# EAGLE design RailDriver (EAGLE 6.6.0)

## Sheet 1 of 2
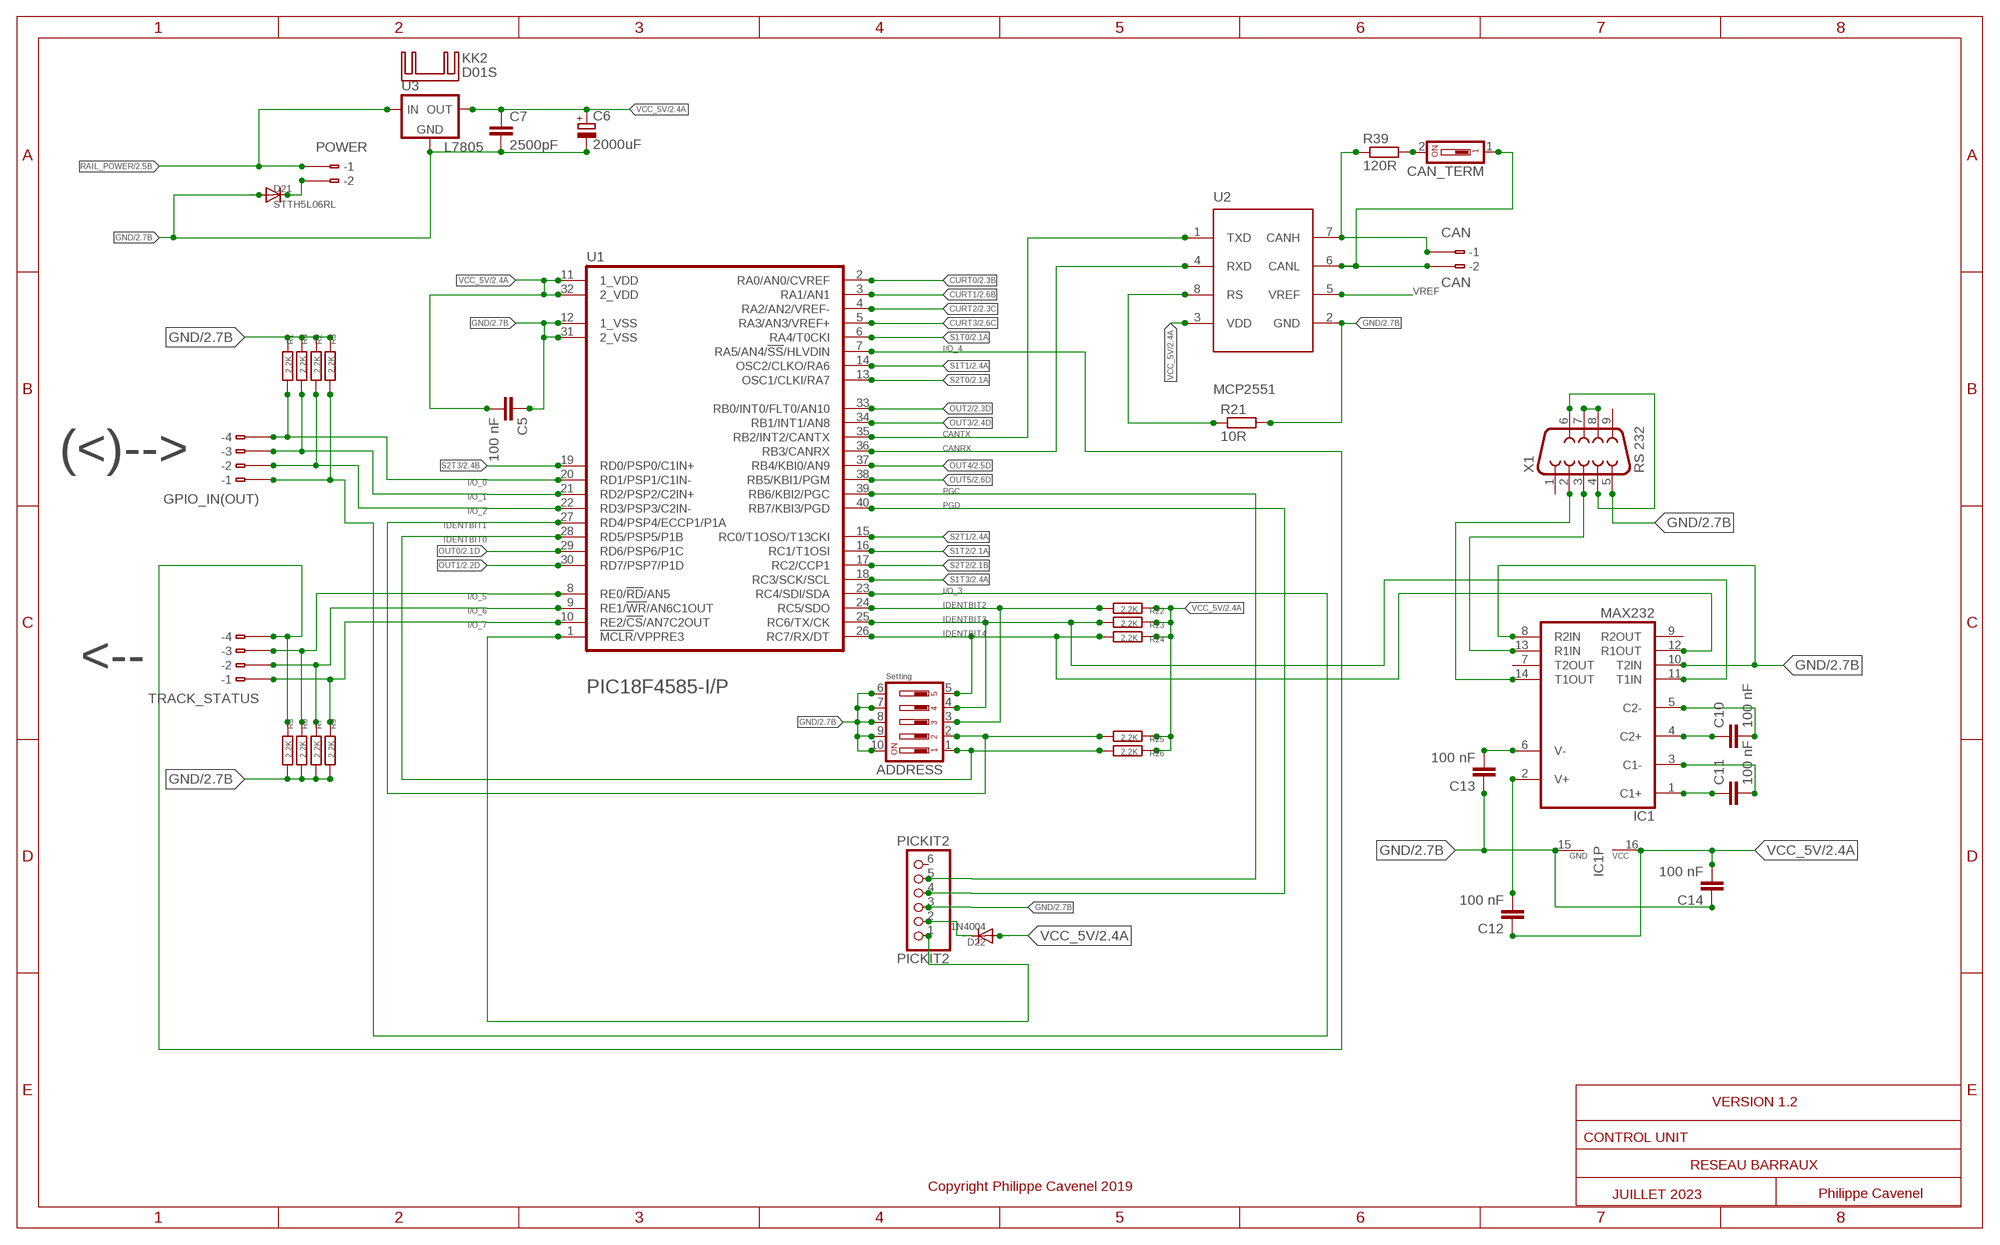
[diagram p0: schematic, sheet 1]

### Parts
ADDRESS  DIP05YL  [DIP05YL]
C5  100 nF  C-EU050-024X044  [C050-024X044]
C6  2000uF  CPOL-EUE3.5-10  [E3,5-10]
C7  2500pF  C-EU050-024X044  [C050-024X044]
C10  100 nF  C-EU050-024X044  [C050-024X044]
C11  100 nF  C-EU050-024X044  [C050-024X044]
C12  100 nF  C-EU050-024X044  [C050-024X044]
C13  100 nF  C-EU050-024X044  [C050-024X044]
C14  100 nF  C-EU050-024X044  [C050-024X044]
CAN  CAN  233-502  [233-502]
CAN_TERM  DS01  [DS-01]
D21  STTH5L06RL  1N5400  [DO201-15]
D22  1N4004  [DO41-10]
GPIO_IN(OUT)  233-504  [233-504]
IC1  MAX232  [DIL16]
KK2  D01S  [D01S]
PICKIT2  PICKIT2  PINHD-1X6  [1X06]
POWER  233-502  [233-502]
R1  2,2K  R-EU_0204/7  [0204/7]
R2  2,2K  R-EU_0204/7  [0204/7]
R3  2,2K  R-EU_0204/7  [0204/7]
R4  2,2K  R-EU_0204/7  [0204/7]
R5  2,2K  R-EU_0204/7  [0204/7]
R6  2,2K  R-EU_0204/7  [0204/7]
R7  2,2K  R-EU_0204/7  [0204/7]
R9  2,2K  R-EU_0204/7  [0204/7]
R21  10R  R-EU_0204/7  [0204/7]
R22  2,2K  R-EU_0204/7  [0204/7]
R23  2,2K  R-EU_0204/7  [0204/7]
R24  2,2K  R-EU_0204/7  [0204/7]
R25  2,2K  R-EU_0204/7  [0204/7]
R26  2,2K  R-EU_0204/7  [0204/7]
R39  120R  R-EU_0204/7  [0204/7]
TRACK_STATUS  233-504  [233-504]
U1  PIC18F4585-I  MICROCHIP_PIC18F4585-I-PDIL_SOCKET40W  [DIL_SOCKET40W]
U2  MCP2551  MCP2551P  [DIL_SOCKET8]
U3  L7805  78XX-TO220V  [TO220BV]
X1  RS 232  F09HP  [F09HP]

### Nets
CANRX: U1.36(RB3/CANRX) U2.4(RXD)
CANTX: U1.35(RB2/INT2/CANTX) U2.1(TXD)
CURT0: U1.2(RA0/AN0/CVREF) ; also sheet 2
CURT1 [VSS]: U1.3(RA1/AN1) ; also sheet 2
CURT2 [VSS]: U1.4(RA2/AN2/VREF-) ; also sheet 2
CURT3 [VSS]: U1.5(RA3/AN3/VREF+) ; also sheet 2
GND [VSS]: ADDRESS.6 ADDRESS.7 ADDRESS.8 ADDRESS.9 ADDRESS.10 C5.1 C6.- C7.2 C13.1 C14.1 D21.A IC1.8(R2IN) IC1.10(T2IN) IC1.15(GND) PICKIT2.3 R1.2 R2.2 R3.2 R4.2 R5.1 R6.1 R7.1 R9.1 R21.2 U1.12(1_VSS) U1.31(2_VSS) U2.2(GND) U3.2(GND) X1.5 ; also sheet 2
I/O_0: GPIO_IN(OUT).B4(B-4) R1.1 U1.20(RD1/PSP1/C1IN-)
I/O_1: GPIO_IN(OUT).B3(B-3) R4.1 U1.21(RD2/PSP2/C2IN+)
I/O_2: GPIO_IN(OUT).B2(B-2) R2.1 U1.22(RD3/PSP3/C2IN-)
I/O_3: GPIO_IN(OUT).B1(B-1) R3.1 U1.23(RC4/SDI/SDA)
I/O_4: R5.2 TRACK_STATUS.B4(B-4) U1.7(RA5/AN4/!SS!/HLVDIN)
I/O_5: R6.2 TRACK_STATUS.B3(B-3) U1.8(RE0/!RD!/AN5)
I/O_6: R7.2 TRACK_STATUS.B2(B-2) U1.9(RE1/!WR!/AN6C1OUT)
I/O_7: R9.2 TRACK_STATUS.B1(B-1) U1.10(RE2/!CS!/AN7C2OUT)
IDENTBIT0: ADDRESS.1 R26.1 U1.28(RD5/PSP5/P1B)
IDENTBIT1: ADDRESS.2 R25.1 U1.27(RD4/PSP4/ECCP1/P1A)
IDENTBIT2: ADDRESS.3 R22.1 U1.24(RC5/SDO)
IDENTBIT3: ADDRESS.4 IC1.11(T1IN) R23.1 U1.25(RC6/TX/CK)
IDENTBIT4: ADDRESS.5 IC1.12(R1OUT) R24.1 U1.26(RC7/RX/DT)
N$1: D22.C PICKIT2.2
N$2: CAN_TERM.2 R39.2
N$8: C10.2 IC1.5(C2-)
N$9: C10.1 IC1.4(C2+)
N$10: C11.1 IC1.1(C1+)
N$11: C11.2 IC1.3(C1-)
N$12: C12.2 IC1.2(V+)
N$13: C13.2 IC1.6(V-)
N$15: IC1.13(R1IN) X1.3
N$16: IC1.14(T1OUT) X1.2
N$17: X1.4 X1.6
N$18: X1.7 X1.8
N$20: CAN.B1(B-1) R39.1 U2.7(CANH)
N$21: CAN.B2(B-2) CAN_TERM.1 U2.6(CANL)
N$27: R21.1 U2.8(RS)
N$29 [VSS]: D21.C POWER.B2(B-2)
N$117: PICKIT2.1 U1.1(!MCLR!/VPPRE3)
OUT0: U1.29(RD6/PSP6/P1C) ; also sheet 2
OUT1: U1.30(RD7/PSP7/P1D) ; also sheet 2
OUT2: U1.33(RB0/INT0/FLT0/AN10) ; also sheet 2
OUT3: U1.34(RB1/INT1/AN8) ; also sheet 2
OUT4: U1.37(RB4/KBI0/AN9) ; also sheet 2
OUT5: U1.38(RB5/KBI1/PGM) ; also sheet 2
PGC: PICKIT2.5 U1.39(RB6/KBI2/PGC)
PGD: PICKIT2.4 U1.40(RB7/KBI3/PGD)
RAIL_POWER [VSS]: POWER.B1(B-1) U3.1(VIN) ; also sheet 2
S1T0: U1.6(RA4/T0CKI) ; also sheet 2
S1T1: U1.14(OSC2/CLKO/RA6) ; also sheet 2
S1T2: U1.16(RC1/T1OSI) ; also sheet 2
S1T3: U1.18(RC3/SCK/SCL) ; also sheet 2
S2T0: U1.13(OSC1/CLKI/RA7) ; also sheet 2
S2T1: U1.15(RC0/T1OSO/T13CKI) ; also sheet 2
S2T2: U1.17(RC2/CCP1) ; also sheet 2
S2T3: U1.19(RD0/PSP0/C1IN+) ; also sheet 2
VCC_5V [VCC]: C5.2 C6.+ C7.1 C12.1 C14.2 D22.A IC1.16(VCC) R22.2 R23.2 R24.2 R25.2 R26.2 U1.11(1_VDD) U1.32(2_VDD) U2.3(VDD) U3.3(VOUT) ; also sheet 2
VREF: U2.5(VREF)
Unconnected: CAN.A1(-1) CAN.A2(-2) GPIO_IN(OUT).A1(-1) GPIO_IN(OUT).A2(-2) GPIO_IN(OUT).A3(-3) GPIO_IN(OUT).A4(-4) IC1.7(T2OUT) IC1.9(R2OUT) PICKIT2.6 POWER.A1(-1) POWER.A2(-2) TRACK_STATUS.A1(-1) TRACK_STATUS.A2(-2) TRACK_STATUS.A3(-3) TRACK_STATUS.A4(-4) X1.1 X1.9

### Notes on the sheet
- (<)-->
- <--
- Setting
- VERSION 1.2
- CONTROL UNIT
- RESEAU BARRAUX
- Copyright Philippe Cavenel 2019
- JUILLET 2023 | Philippe Cavenel

## Sheet 2 of 2
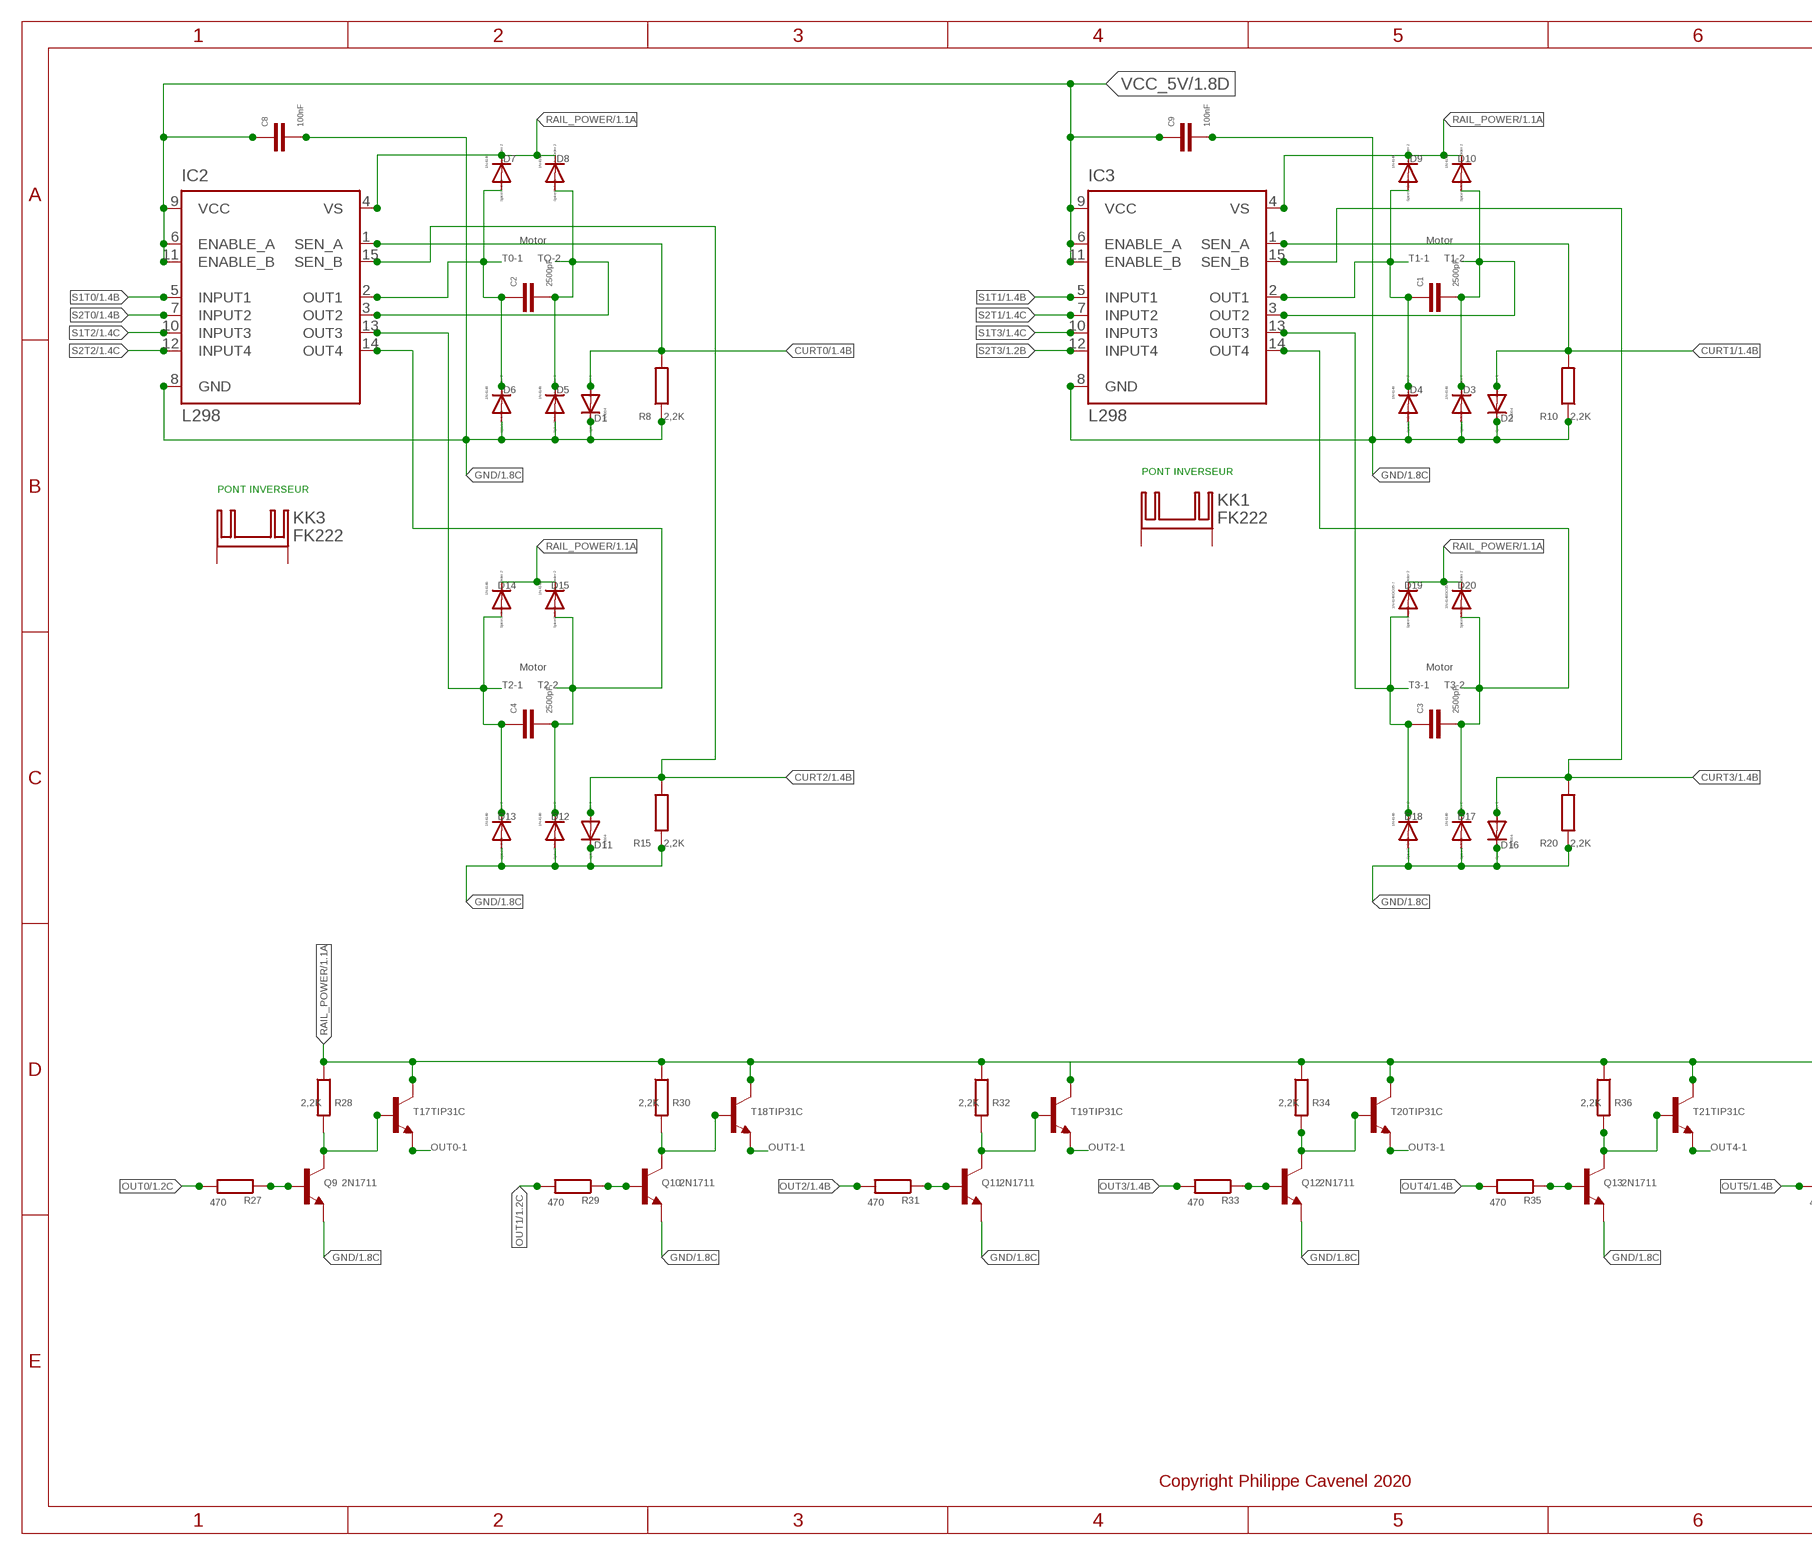
[diagram p1: schematic, sheet 2, part 1 of 2]
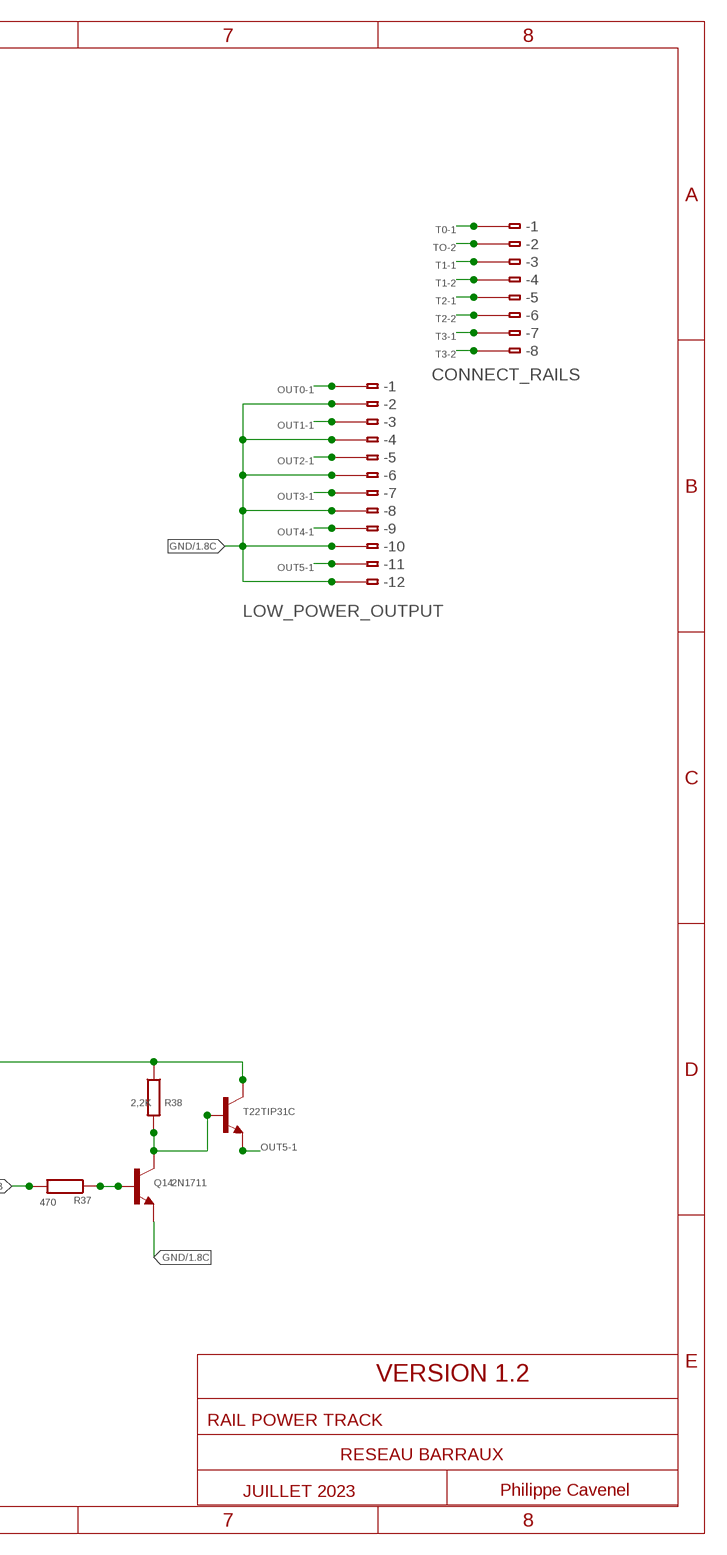
[diagram p2: schematic, sheet 2, part 2 of 2]

### Parts
C1  2500pF  C-EU050-024X044  [C050-024X044]
C2  2500pF  C-EU050-024X044  [C050-024X044]
C3  2500pF  C-EU050-024X044  [C050-024X044]
C4  2500pF  C-EU050-024X044  [C050-024X044]
C8  100nF  C-EU050-024X044  [C050-024X044]
C9  100nF  C-EU050-024X044  [C050-024X044]
CONNECT_RAILS  233-508  [233-508]
D1  1N4004  [DO41-10]
D2  1N4004  [DO41-10]
D3  1N4148  1N4148DO35-7  [DO35-7]
D4  1N4148  1N4148DO35-7  [DO35-7]
D5  1N4148  1N4148DO35-7  [DO35-7]
D6  1N4148  1N4148DO35-7  [DO35-7]
D7  1N4148  1N4148DO35-7  [DO35-7]
D8  1N4148  1N4148DO35-7  [DO35-7]
D9  1N4148  1N4148DO35-7  [DO35-7]
D10  1N4148  1N4148DO35-7  [DO35-7]
D11  1N4004  [DO41-10]
D12  1N4148  1N4148DO35-7  [DO35-7]
D13  1N4148  1N4148DO35-7  [DO35-7]
D14  1N4148  1N4148DO35-7  [DO35-7]
D15  1N4148  1N4148DO35-7  [DO35-7]
D16  1N4004  [DO41-10]
D17  1N4148  1N4148DO35-7  [DO35-7]
D18  1N4148  1N4148DO35-7  [DO35-7]
D19  1N4148DO35-7  [DO35-7]
D20  1N4148DO35-7  [DO35-7]
IC2  L298  [MULTIWATT-15]
IC3  L298  [MULTIWATT-15]
KK1  FK222  [FK222]
KK3  FK222  [FK222]
LOW_POWER_OUTPUT  233-512  [233-512]
Q9  2N1711  [TO39]
Q10  2N1711  [TO39]
Q11  2N1711  [TO39]
Q12  2N1711  [TO39]
Q13  2N1711  [TO39]
Q14  2N1711  [TO39]
R8  2,2K  R-EU_0204/7  [0204/7]
R10  2,2K  R-EU_0204/7  [0204/7]
R15  2,2K  R-EU_0204/7  [0204/7]
R20  2,2K  R-EU_0204/7  [0204/7]
R27  470  R-EU_0204/7  [0204/7]
R28  2,2K  R-EU_0204/7  [0204/7]
R29  470  R-EU_0204/7  [0204/7]
R30  2,2K  R-EU_0204/7  [0204/7]
R31  470  R-EU_0204/7  [0204/7]
R32  2,2K  R-EU_0204/7  [0204/7]
R33  470  R-EU_0204/7  [0204/7]
R34  2,2K  R-EU_0204/7  [0204/7]
R35  470  R-EU_0204/7  [0204/7]
R36  2,2K  R-EU_0204/7  [0204/7]
R37  470  R-EU_0204/7  [0204/7]
R38  2,2K  R-EU_0204/7  [0204/7]
T17  TIP31C  [TO220]
T18  TIP31C  [TO220]
T19  TIP31C  [TO220]
T20  TIP31C  [TO220]
T21  TIP31C  [TO220]
T22  TIP31C  [TO220]

### Nets
CURT0: D1.A IC2.1(SEN_A) R8.2 ; also sheet 1
CURT1 [VSS]: D2.A IC3.1(SEN_A) R10.2 ; also sheet 1
CURT2 [VSS]: D11.A IC2.15(SEN_B) R15.2 ; also sheet 1
CURT3 [VSS]: D16.A IC3.15(SEN_B) R20.2 ; also sheet 1
GND [VSS]: C8.2 C9.2 D1.C D2.C D3.A D4.A D5.A D6.A D11.C D12.A D13.A D16.C D17.A D18.A IC2.8(GND) IC3.8(GND) LOW_POWER_OUTPUT.B2(B-2) LOW_POWER_OUTPUT.B4(B-4) LOW_POWER_OUTPUT.B6(B-6) LOW_POWER_OUTPUT.B8(B-8) LOW_POWER_OUTPUT.B10(B-10) LOW_POWER_OUTPUT.B12(B-12) Q9.1(E) Q10.1(E) Q11.1(E) Q12.1(E) Q13.1(E) Q14.1(E) R8.1 R10.1 R15.1 R20.1 ; also sheet 1
N$28: Q9.3(C) R28.2 T17.1(B)
N$30: Q9.2(B) R27.1
N$31: Q10.3(C) R30.2 T18.1(B)
N$33: Q10.2(B) R29.1
N$34: Q11.3(C) R32.2 T19.1(B)
N$36: Q11.2(B) R31.1
N$37: Q12.3(C) R34.2 T20.1(B)
N$39: Q12.2(B) R33.1
N$40: Q13.3(C) R36.2 T21.1(B)
N$42: Q13.2(B) R35.1
N$43: Q14.3(C) R38.2 T22.1(B)
N$45: Q14.2(B) R37.1
OUT0: R27.2 ; also sheet 1
OUT0-1 [VSS]: LOW_POWER_OUTPUT.B1(B-1) T17.3(E)
OUT1: R29.2 ; also sheet 1
OUT1-1 [VSS]: LOW_POWER_OUTPUT.B3(B-3) T18.3(E)
OUT2: R31.2 ; also sheet 1
OUT2-1 [VSS]: LOW_POWER_OUTPUT.B5(B-5) T19.3(E)
OUT3: R33.2 ; also sheet 1
OUT3-1 [VSS]: LOW_POWER_OUTPUT.B7(B-7) T20.3(E)
OUT4: R35.2 ; also sheet 1
OUT4-1 [VSS]: LOW_POWER_OUTPUT.B9(B-9) T21.3(E)
OUT5: R37.2 ; also sheet 1
OUT5-1 [VSS]: LOW_POWER_OUTPUT.B11(B-11) T22.3(E)
RAIL_POWER [VSS]: D7.C D8.C D9.C D10.C D14.C D15.C D19.C D20.C IC2.4(VS) IC3.4(VS) R28.1 R30.1 R32.1 R34.1 R36.1 R38.1 T17.2(C) T18.2(C) T19.2(C) T20.2(C) T21.2(C) T22.2(C) ; also sheet 1
S1T0: IC2.5(INPUT1) ; also sheet 1
S1T1: IC3.5(INPUT1) ; also sheet 1
S1T2: IC2.10(INPUT3) ; also sheet 1
S1T3: IC3.10(INPUT3) ; also sheet 1
S2T0: IC2.7(INPUT2) ; also sheet 1
S2T1: IC3.7(INPUT2) ; also sheet 1
S2T2: IC2.12(INPUT4) ; also sheet 1
S2T3: IC3.12(INPUT4) ; also sheet 1
T0-1 [VSS]: C2.1 CONNECT_RAILS.B1(B-1) D6.C D7.A IC2.2(OUT1)
T1-1 [VSS]: C1.1 CONNECT_RAILS.B3(B-3) D4.C D9.A IC3.2(OUT1)
T1-2 [VSS]: C1.2 CONNECT_RAILS.B4(B-4) D3.C D10.A IC3.3(OUT2)
T2-1 [VSS]: C4.1 CONNECT_RAILS.B5(B-5) D13.C D14.A IC2.13(OUT3)
T2-2 [VSS]: C4.2 CONNECT_RAILS.B6(B-6) D12.C D15.A IC2.14(OUT4)
T3-1 [VSS]: C3.1 CONNECT_RAILS.B7(B-7) D18.C D19.A IC3.13(OUT3)
T3-2 [VSS]: C3.2 CONNECT_RAILS.B8(B-8) D17.C D20.A IC3.14(OUT4)
TO-2 [VSS]: C2.2 CONNECT_RAILS.B2(B-2) D5.C D8.A IC2.3(OUT2)
VCC_5V [VCC]: C8.1 C9.1 IC2.6(ENABLE_A) IC2.9(VCC) IC2.11(ENABLE_B) IC3.6(ENABLE_A) IC3.9(VCC) IC3.11(ENABLE_B) ; also sheet 1
Unconnected: CONNECT_RAILS.A1(-1) CONNECT_RAILS.A2(-2) CONNECT_RAILS.A3(-3) CONNECT_RAILS.A4(-4) CONNECT_RAILS.A5(-5) CONNECT_RAILS.A6(-6) CONNECT_RAILS.A7(-7) CONNECT_RAILS.A8(-8) KK1.A2,8(K) KK1.B2,8(K) KK3.A2,8(K) KK3.B2,8(K) LOW_POWER_OUTPUT.A1(-1) LOW_POWER_OUTPUT.A2(-2) LOW_POWER_OUTPUT.A3(-3) LOW_POWER_OUTPUT.A4(-4) LOW_POWER_OUTPUT.A5(-5) LOW_POWER_OUTPUT.A6(-6) LOW_POWER_OUTPUT.A7(-7) LOW_POWER_OUTPUT.A8(-8) LOW_POWER_OUTPUT.A9(-9) LOW_POWER_OUTPUT.A10(-10) LOW_POWER_OUTPUT.A11(-11) LOW_POWER_OUTPUT.A12(-12)

### Notes on the sheet
- Motor | Motor
- PONT INVERSEUR
- PONT INVERSEUR
- Motor | Motor
- VERSION 1.2
- RAIL POWER TRACK
- RESEAU BARRAUX
- Copyright Philippe Cavenel 2020
- JUILLET 2023 | Philippe Cavenel

## Library data of the parts
ADDRESS = switch-dil:DIP05YL: DIL/CODE SWITCH; OC_FARNELL: unknown; OC_NEWARK: unknown
C1-C5 C7-C14 = resistor:C-EU: CAPACITOR, European symbol
C6 = rcl:CPOL-EU: POLARIZED CAPACITOR, European symbol
CAN POWER = con-wago:233-502: WAGO Cage Clamp; MPN: 233-502; OC_FARNELL: 1777096; OC_NEWARK: 58M2630
CAN_TERM = switch-dil:DS01: DIL/CODE SWITCH; OC_FARNELL: unknown; OC_NEWARK: unknown
CONNECT_RAILS = con-wago:233-508: WAGO Cage Clamp; MF: Wago Corporation; MPN: 0233-0508; OC_FARNELL: 1777101; OC_NEWARK: 79K2053
D1 D2 D11 D16 D22 = diode:1N4004: DIODE general purpose rectifier, 1 A
D3-D10 D12-D15 D17-D20 = diode:1N4148: DIODE high speed (Philips)
D21 = diode:1N5400: DIODE standard rectifier, 3 A, 50 V (Motorola)
GPIO_IN(OUT) TRACK_STATUS = con-wago:233-504: WAGO Cage Clamp; MF: Wago Corporation; MPN: 0233-0504; OC_FARNELL: 1777098; OC_NEWARK: 79K2050
IC1 = maxim:MAX232: RS232 TRANSCEIVER; MF: MAXIM; MPN: MAX232ACPE+; OC_FARNELL: 9723773; OC_NEWARK: 68K4544
IC2 IC3 = st-microelectronics:L298: DUAL FULL-BRIDGE DRIVER; MPN: L298N; OC_FARNELL: 1589425; OC_NEWARK: 32M1527
KK1 KK3 = heatsink:FK222: HEATSINK manufacturer Fischer/distributor Buerklin
KK2 = heatsink:D01S: HEATSINK distributor Schukat
LOW_POWER_OUTPUT = con-wago:233-512: WAGO Cage Clamp; MF: Wago Corporation; MPN: 0233-0512; OC_FARNELL: 1777102; OC_NEWARK: 79K2055
PICKIT2 = pinhead:PINHD-1X6: PIN HEADER
Q9-Q14 = transistor-npn:2N1711: NPN Transistor
R1-R7 R9 R21-R26 R39 = resistor:R-EU_: RESISTOR, European symbol
R8 R10 R15 R20 R27-R38 = rcl:R-EU_: RESISTOR, European symbol
T17-T22 = transistor:TIP31: NPN Transistor Medium Power Linear Switching Applications Source: http://onsemi.com
U1 = PIC18F4585-I:MICROCHIP_PIC18F4585-I-P: MC-8B-18F4585-IL40; CIIVA_IDS: 1159501; DATASHEET_VERSION: revC, Jan-2007; FOOTPRINT_VARIANT_NAME_0: Manufacturer Recommended; IMPORTED: yes; IMPORTED_FROM: vault; IMPORT_TS: 1521860469; MF: Microchip; MPN: PIC18F4585-I/P; PACKAGE: PDIP600-P40; PACKAGE_DESCRIPTION: 40-Lead Plastic Dual In-Line (P) - 600 mil Body [PDIP]; PACKAGE_VERSION: revBB, Aug-2009; PREFIX: U; RELEASE_DATE: 1300262685; VAULT_GUID: 210E116F-6B5F-434B-BA1E-B828BFE41178; VAULT_REVISION: E650CF94-49B9-4BD2-BA8F-78EDCB57BA09
U2 = microchip_can:MCP2551: High Speed CAN tranceiver
U3 = bt_regulator:78XX: 78XX Linear Voltage Regulator The venerable 7800-series Linear Voltage Regulator, including 7805, 7809, 7812, 7815, 7862 in 5 V, 6.2 V, 8.2 V, 9 V, 12 V, and 15 V, respectively Datasheets TI_LM78L05.pdf <http://www.ti.com/lit/ds/symlink/lm78l05.pdf> Fairchild_LM7805.pdf <https://www.fairchildsemi.com/datasheets/LM/LM7805.pdf>
X1 = con-subd:F09: SUB-D; OC_FARNELL: unknown; OC_NEWARK: unknown

## Net classes
0 default: width 0.254 mm, clearance 0.355 mm
1 VSS: width 0.762 mm, clearance 0.355 mm to class 0, clearance 0.355 mm
2 Antenna: width 1.27 mm
3 VCC: width 0.406 mm, clearance 0.355 mm to class 0, clearance 0.355 mm to class 1, clearance 0.355 mm to class 2, clearance 0.355 mm

## Board
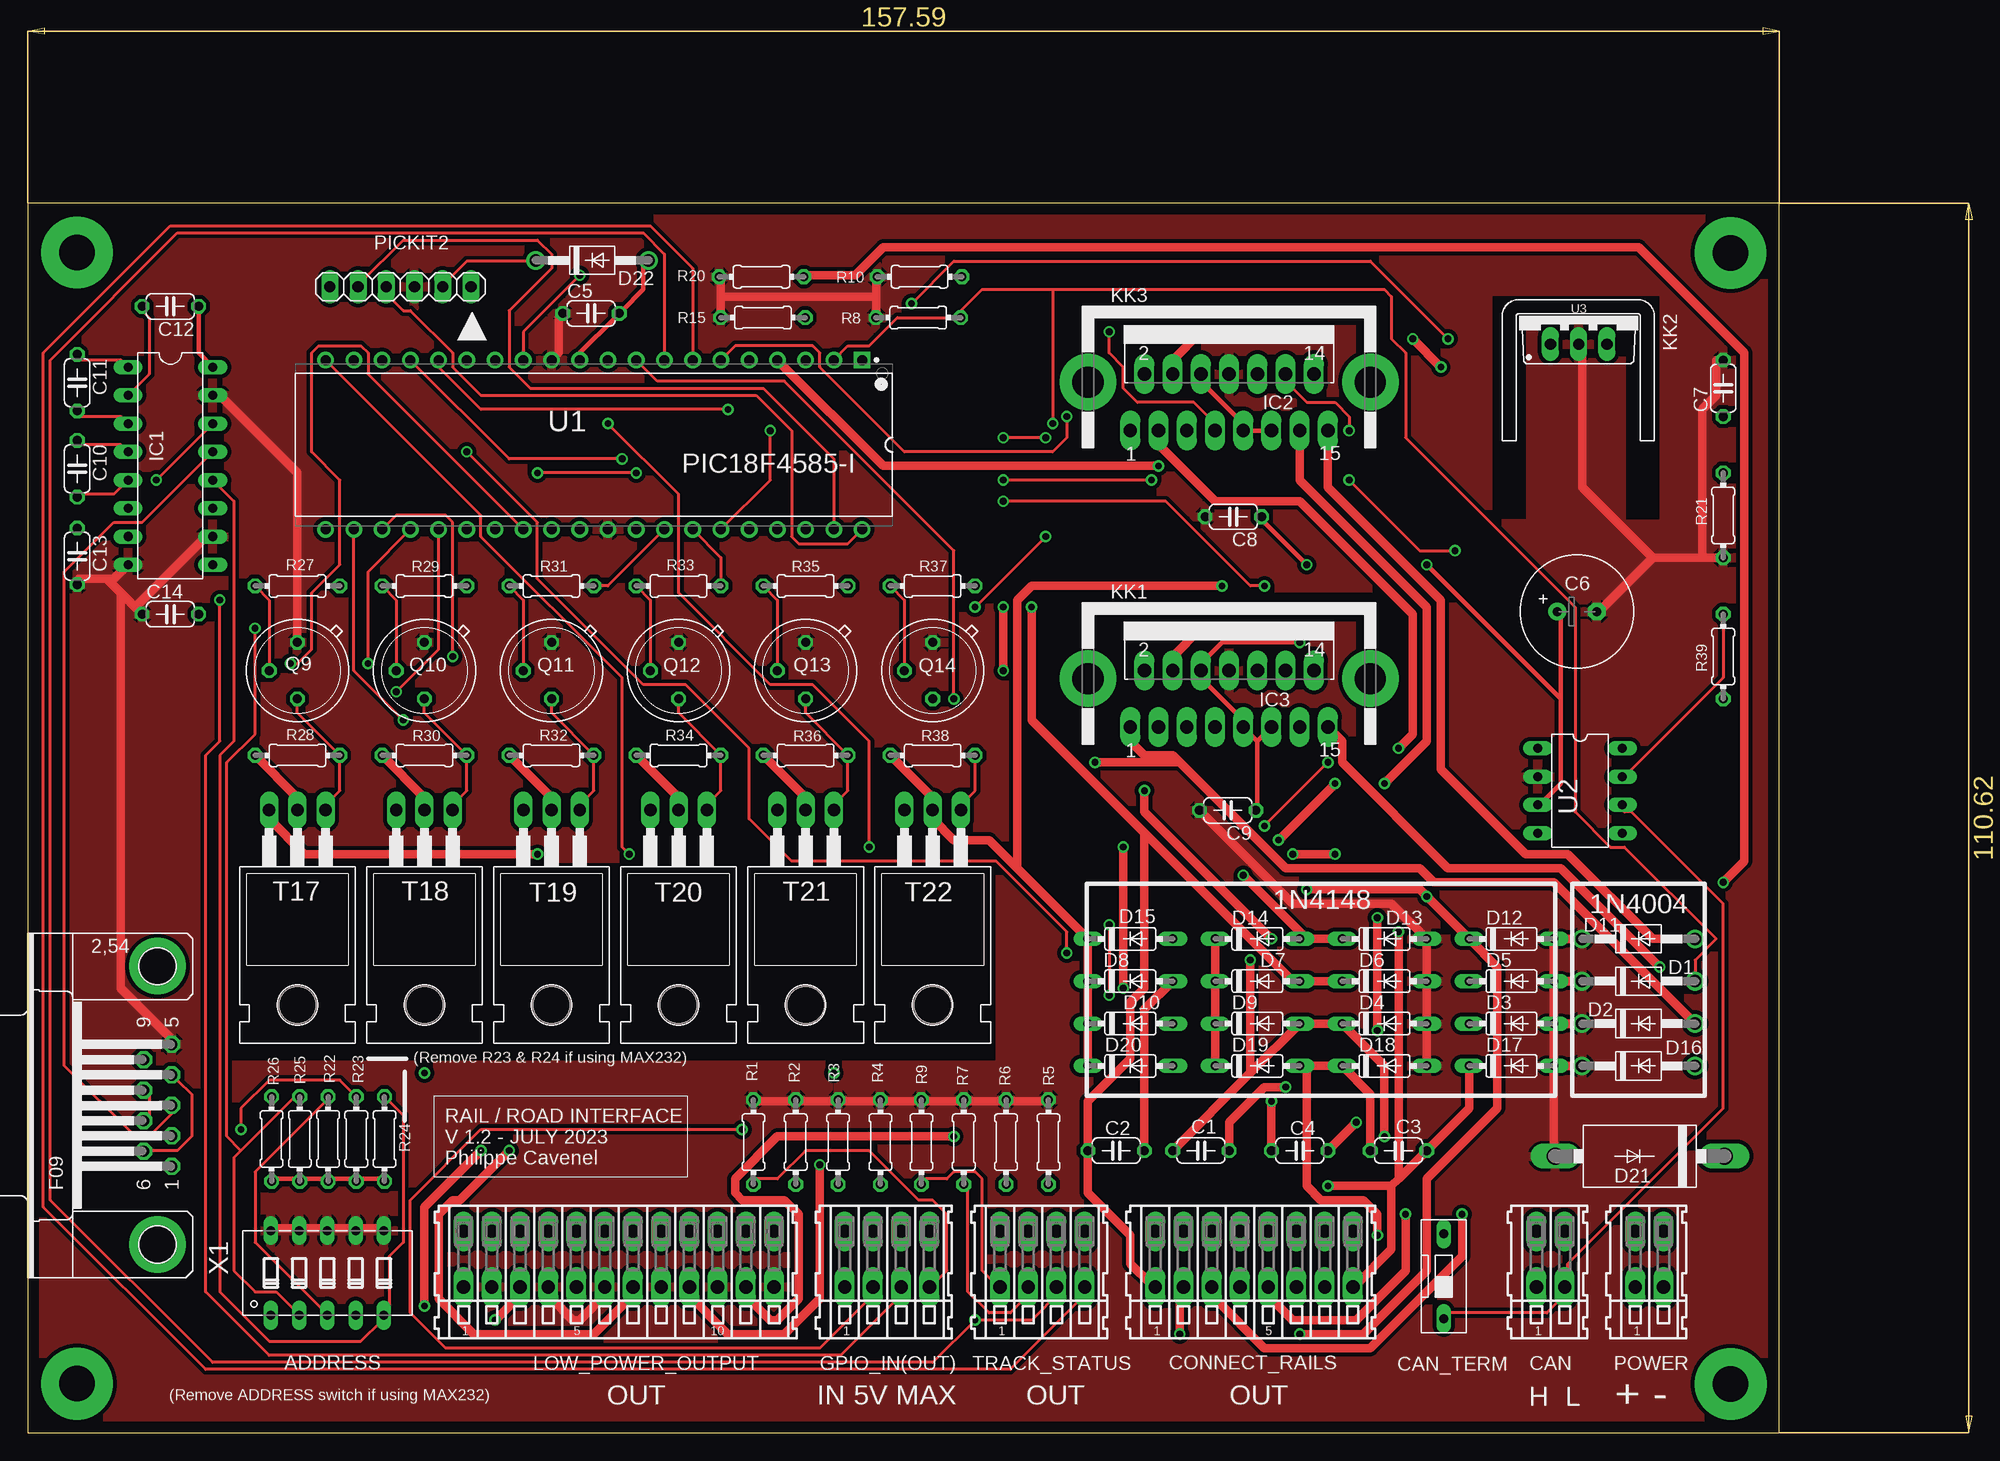
[diagram p3: board, top side]
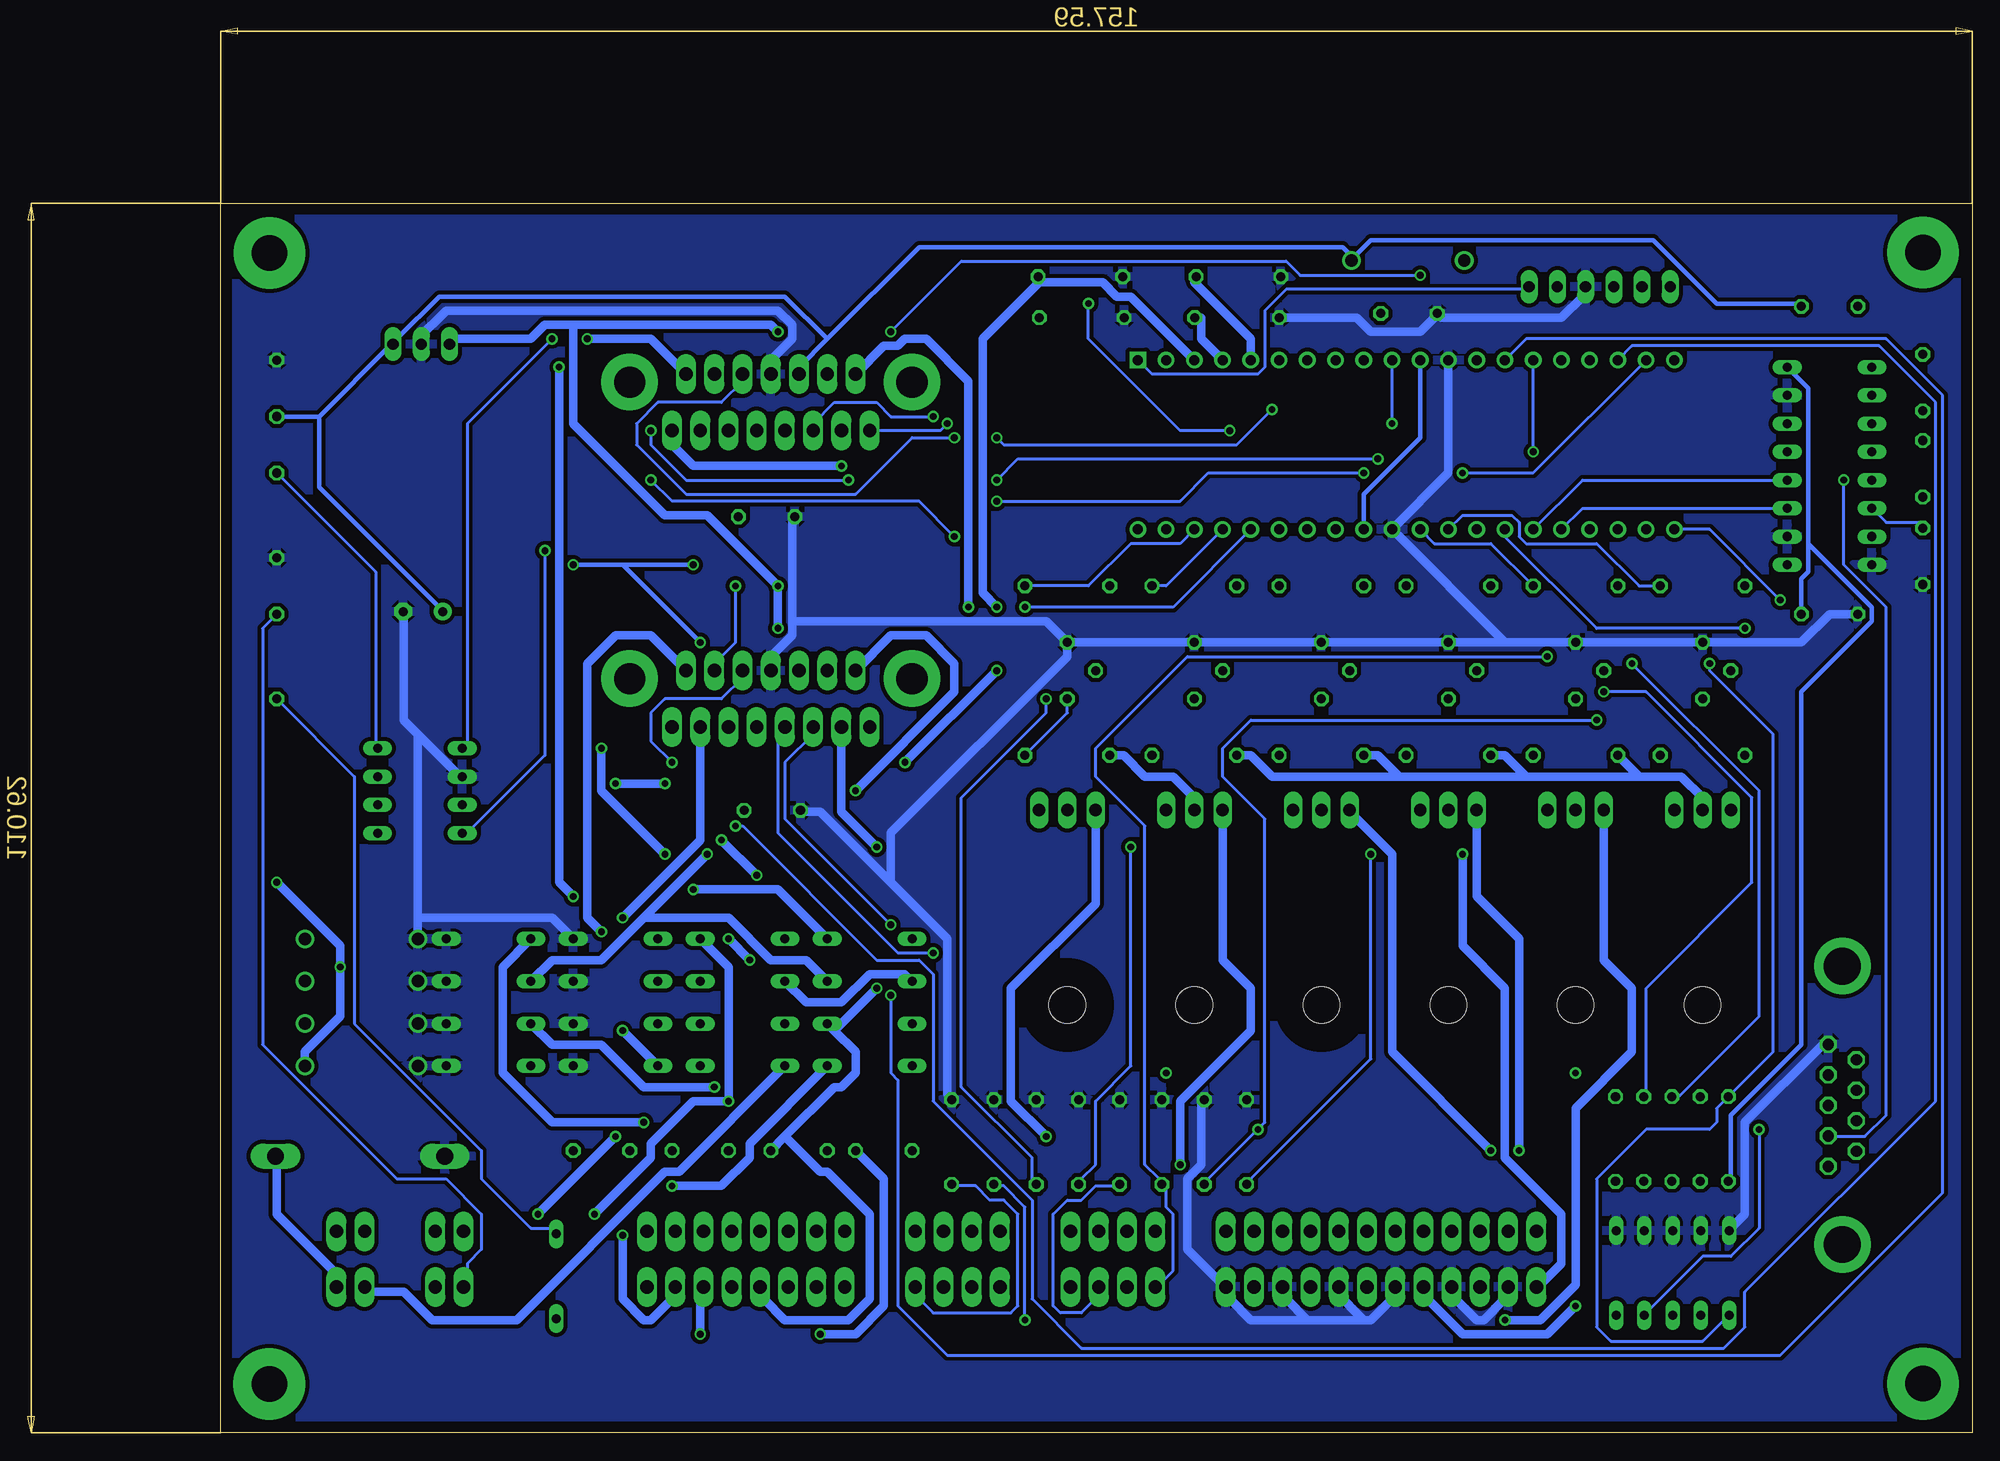
[diagram p4: board, bottom side, seen from below]

Size 157.59 x 110.62 mm. Coordinates in mm from the lower left corner, seen from the top.
Outline: 0,0 22.99,0 45.47,0 157.59,0 157.59,110.62 0,110.62 0,0
Copper layers (1*16): Top 0.035mm / dielectric 1.5mm / Bottom 0.035mm
Design rules "RailDriver": minimum track width 10mil, minimum drill 24mil, track to track 0.205mm, track to pad 0.205mm, pad to pad 0.205mm, via to via 0.205mm, smd to smd 8mil, copper to edge 40mil, drill to drill 8mil, minimum pad ring 10mil, minimum via ring 8mil, stop-mask expansion 4mil, vias tented up to drill 0mil, thermal gap 10mil
tRestrict: area 131.8,99.7 to 146.8,102.3; area 131.8,82.3 to 134.8,102.3; area 143.8,82.2 to 146.8,102.2; area 18.7,33.5 to 87,51.3

### Footprints (pad centres in the part's own frame; a part is rotated, then mirrored left to right if it is on the bottom)
DIP05YL = drill 0.813 long: 1 -5.08,-3.81; 2 -2.54,-3.81; 3 0,-3.81; 4 2.54,-3.81; 5 5.08,-3.81; 6 5.08,3.81; 7 2.54,3.81; 8 0,3.81; 9 -2.54,3.81; 10 -5.08,3.81
C050-024X044 = drill 0.813 octagon: 1 -2.54,0; 2 2.54,0
E3,5-10 = drill 0.813 pad 1.6: + -1.778,0 | drill 0.813 pad 1.6 octagon: - 1.778,0
233-502 = drill 1.2 long: A1 -1.27,2.5; A2 1.27,2.5; B1 -1.27,-2.5; B2 1.27,-2.5
DS-01 = drill 0.813 long: 1 0,-3.81; 2 0,3.81
233-508 = drill 1.2 long: A1 -8.89,2.5; A2 -6.35,2.5; A3 -3.81,2.5; A4 -1.27,2.5; A5 1.27,2.5; A6 3.81,2.5; A7 6.35,2.5; A8 8.89,2.5; B1 -8.89,-2.5; B2 -6.35,-2.5; B3 -3.81,-2.5; B4 -1.27,-2.5; B5 1.27,-2.5; B6 3.81,-2.5; B7 6.35,-2.5; B8 8.89,-2.5
DO41-10 = drill 1.118: A 5.08,0; C -5.08,0
DO35-7 = drill 0.813 long: A 3.81,0; C -3.81,0
DO201-15 = drill 1.499 long: A 7.62,0; C -7.62,0
233-504 = drill 1.2 long: A1 -3.81,2.5; A2 -1.27,2.5; A3 1.27,2.5; A4 3.81,2.5; B1 -3.81,-2.5; B2 -1.27,-2.5; B3 1.27,-2.5; B4 3.81,-2.5
DIL16 = drill 0.813 long: 1 -8.89,-3.81; 2 -6.35,-3.81; 3 -3.81,-3.81; 4 -1.27,-3.81; 5 1.27,-3.81; 6 3.81,-3.81; 7 6.35,-3.81; 8 8.89,-3.81; 9 8.89,3.81; 10 6.35,3.81; 11 3.81,3.81; 12 1.27,3.81; 13 -1.27,3.81; 14 -3.81,3.81; 15 -6.35,3.81; 16 -8.89,3.81
MULTIWATT-15 = drill 1.2 long: 1 -8.89,-7.62; 2 -7.62,-2.54; 3 -6.35,-7.62; 4 -5.08,-2.54; 5 -3.81,-7.62; 6 -2.54,-2.54; 7 -1.27,-7.62; 8 0,-2.54; 9 1.27,-7.62; 10 2.54,-2.54; 11 3.81,-7.62; 12 5.08,-2.54; 13 6.35,-7.62; 14 7.62,-2.54; 15 8.89,-7.62
FK222 = drill 2.794 pad 5.08: A2,8 5.791,-12.7; B2,8 5.791,12.7
233-512 = drill 1.2 long: A1 -13.97,2.5; A2 -11.43,2.5; A3 -8.89,2.5; A4 -6.35,2.5; A5 -3.81,2.5; A6 -1.27,2.5; A7 1.27,2.5; A8 3.81,2.5; A9 6.35,2.5; A10 8.89,2.5; A11 11.43,2.5; A12 13.97,2.5; B1 -13.97,-2.5; B2 -11.43,-2.5; B3 -8.89,-2.5; B4 -6.35,-2.5; B5 -3.81,-2.5; B6 -1.27,-2.5; B7 1.27,-2.5; B8 3.81,-2.5; B9 6.35,-2.5; B10 8.89,-2.5; B11 11.43,-2.5; B12 13.97,-2.5
1X06 = drill 1.016 long: 1 -6.35,0; 2 -3.81,0; 3 -1.27,0; 4 1.27,0; 5 3.81,0; 6 6.35,0
TO39 = drill 0.813 octagon: 1 0,-2.54; 2 2.54,0; 3 0,2.54
0204/7 = drill 0.813 octagon: 1 -3.81,0; 2 3.81,0
TO220 = drill 1.118 long: 1 -2.54,-6.35; 2 0,-6.35; 3 2.54,-6.35 | hole 3.302: 0,11.176
DIL_SOCKET40W = drill 0.9 pad 1.5 square: 1 -24.13,-7.62 | drill 0.9 pad 1.5: 2 -21.59,-7.62; 3 -19.05,-7.62; 4 -16.51,-7.62; 5 -13.97,-7.62; 6 -11.43,-7.62; 7 -8.89,-7.62; 8 -6.35,-7.62; 9 -3.81,-7.62; 10 -1.27,-7.62; 11 1.27,-7.62; 12 3.81,-7.62; 13 6.35,-7.62; 14 8.89,-7.62; 15 11.43,-7.62; 16 13.97,-7.62; 17 16.51,-7.62; 18 19.05,-7.62; 19 21.59,-7.62; 20 24.13,-7.62; 21 24.13,7.62; 22 21.59,7.62; 23 19.05,7.62; 24 16.51,7.62; 25 13.97,7.62; 26 11.43,7.62; 27 8.89,7.62; 28 6.35,7.62; 29 3.81,7.62; 30 1.27,7.62; 31 -1.27,7.62; 32 -3.81,7.62; 33 -6.35,7.62; 34 -8.89,7.62; 35 -11.43,7.62; 36 -13.97,7.62; 37 -16.51,7.62; 38 -19.05,7.62; 39 -21.59,7.62; 40 -24.13,7.62
DIL_SOCKET8 = drill 0.813 long: 1 -3.81,-3.81; 2 -1.27,-3.81; 3 1.27,-3.81; 4 3.81,-3.81; 5 3.81,3.81; 6 1.27,3.81; 7 -1.27,3.81; 8 -3.81,3.81
TO220BV = drill 1.016 long: 1 -2.54,0; 2 0,0; 3 2.54,0
F09HP = drill 1.016 octagon: 1 -5.486,-1.27; 2 -2.743,-1.27; 3 0,-1.27; 4 2.743,-1.27; 5 5.486,-1.27; 6 -4.115,1.27; 7 -1.372,1.27; 8 1.372,1.27; 9 4.115,1.27 | drill 3.302 pad 5.08: G1 -12.522,0; G2 12.522,0

### Placement (x,y rotation side)
ADDRESS  26.95,14.39 0 top
C1  105.54,25.4 0 top
C2  97.92,25.4 0 top
C3  123.32,25.4 0 top
C4  114.43,25.4 0 top
C5  50.67,100.71 0 top
C6  139.38,73.89 0 top
C7  152.53,93.98 90 top
C8  108.46,82.42 180 top
C9  107.95,56.01 180 top
C10  4.45,86.74 270 top
C11  4.45,94.49 270 top
C12  12.83,101.35 180 top
C13  4.45,78.87 90 top
C14  12.83,73.66 0 top
CAN  136.99,15.64 0 top
CAN_TERM  127.38,14.1 0 top
CONNECT_RAILS  110.32,15.64 0 top
D1  144.91,40.64 0 top
D2  144.91,36.83 0 top
D3  133.48,36.83 0 top
D4  122.05,36.83 0 top
D5  133.48,40.64 0 top
D6  122.05,40.64 0 top
D7  110.62,40.64 0 top
D8  99.19,40.64 0 top
D9  110.62,36.83 0 top
D10  99.19,36.83 0 top
D11  144.91,44.45 0 top
D12  133.48,44.45 0 top
D13  122.05,44.45 0 top
D14  110.62,44.45 0 top
D15  99.19,44.45 0 top
D16  144.91,33.02 0 top
D17  133.48,33.02 0 top
D18  122.05,33.02 0 top
D19  110.62,33.02 0 top
D20  99.19,33.02 0 top
D21  145.03,24.89 180 top
D22  50.77,105.49 0 top
DRILEGEND  [DRILEGEND]  -6.3,-3.81 0 top  (outside the outline)
GPIO_IN(OUT)  77.3,15.64 0 top
IC1  12.83,87 270 top
IC2  108.08,97.79 0 top
IC3  108.08,71.12 0 top
KK1  108.08,73.66 270 top
KK2  139.48,100.7 180 top
KK3  108.08,100.33 270 top
LOW_POWER_OUTPUT  53.17,15.64 0 top
PICKIT2  33.52,103.12 180 top
POWER  145.88,15.64 0 top
Q9  24.26,68.58 180 top
Q10  35.69,68.58 180 top
Q11  47.12,68.58 180 top
Q12  58.55,68.58 180 top
Q13  69.98,68.58 180 top
Q14  81.41,68.58 180 top
R1  65.28,26.16 90 top
R2  69.09,26.16 90 top
R3  72.9,26.16 90 top
R4  76.71,26.16 90 top
R5  91.82,26.16 270 top
R6  88.01,26.16 270 top
R7  84.2,26.16 270 top
R8  80.1,100.33 0 top
R9  80.39,26.16 270 top
R10  80.23,104.02 0 top
R15  66.13,100.33 0 top
R20  66.01,104.02 0 top
R21  152.53,82.55 270 top
R22  27.01,26.44 270 top
R23  29.55,26.44 270 top
R24  32.09,26.44 270 top
R25  24.47,26.44 270 top
R26  21.93,26.44 270 top
R27  24.26,76.2 0 top
R28  24.26,60.96 0 top
R29  35.69,76.2 0 top
R30  35.69,60.96 0 top
R31  47.12,76.2 0 top
R32  47.12,60.96 0 top
R33  58.55,76.2 0 top
R34  58.55,60.96 0 top
R35  69.98,76.2 0 top
R36  69.98,60.96 0 top
R37  81.41,76.2 0 top
R38  81.41,60.96 0 top
R39  152.53,69.85 270 top
T17  24.26,49.68 180 top
T18  35.69,49.68 180 top
T19  47.12,49.68 180 top
T20  58.55,49.68 180 top
T21  69.98,49.68 180 top
T22  81.41,49.68 180 top
TRACK_STATUS  91.27,15.64 0 top
U1  50.93,88.9 180 top
U2  139.65,57.78 270 top
U3  139.53,97.95 0 top
X1  11.68,29.46 90 top

### Tracks (layer width: path | path; a pad name or v marks a point on that pad's centre or on a via)
CANRX  (via drill 0.61)
  Top 0.254: v128.4,79.38 125.22,79.38 v118.87,85.72 | v85.22,74.3 v91.57,80.64
  Bottom 0.254: v128.4,79.38 128.4,60.96 135.38,53.98 U2.4 | v118.87,85.72 116.97,83.82 94.74,83.82 v91.57,80.64 | v85.22,74.3 71.88,74.3 U1.36
CANTX  (via drill 0.61)
  Top 0.254: v127.76,98.42 120.78,105.41 83.31,105.41 v79.5,101.6 | v66.8,90.17 66.8,85.72 U1.35
  Bottom 0.254: v127.76,98.42 135.38,90.81 135.38,61.59 U2.1 | v79.5,101.6 79.5,98.42 71.25,90.17 v66.8,90.17
CURT0  (via drill 0.61)
  Top 0.254: U1.2 73.79,97.79 75.69,97.79 78.23,100.33 83.31,100.33 R8.2 83.95,100.97 85.85,102.87 92.2,102.87 | D1.A 149.99,42.55 151.89,44.45 143.64,52.7 142.37,52.7 139.19,55.88 139.19,74.3 123.95,89.53 123.95,97.16 122.68,98.42 122.68,102.23 122.05,102.87 92.2,102.87 | 92.2,102.87 v92.2,90.81
  Bottom 0.254: IC2.1 92.84,90.17 v92.2,90.81
CURT1  (via drill 0.61)
  Top 0.762: D2.A 137.29,49.53 126.49,49.53 125.22,50.8 113.16,50.8 103.63,60.33 | 103.63,60.33 103,60.96 100.46,60.96 99.19,62.23 IC3.1 | v87.76,68.58 v87.76,74.3 | 103.63,60.33 v96.01,60.33
  Bottom 0.762: 83.95,103.5 78.23,103.5 76.96,102.23 75.69,102.23 U1.3 | 83.95,103.5 R10.2 83.95,103.5 | 83.95,103.5 89.03,98.42 89.03,75.56 v87.76,74.3 | v96.01,60.33 v87.76,68.58
CURT2  (via drill 0.61)
  Top 0.762: D11.A 146.18,44.45 138.56,52.07 134.75,52.07 127.13,59.69 127.13,74.93 116.97,85.09 IC2.15 | U1.4 76.96,87 v101.73,87
  Bottom 0.762: U1.4 69.34,98.42 69.34,100.33 R15.2 | v101.73,87 115.06,87 116.97,88.9 IC2.15
CURT3  (via drill 0.61)
  Top 0.762: v146.81,41.91 137.92,50.8 127.76,50.8 118.24,60.33 118.24,62.23 IC3.15 | v152.53,49.53 154.43,51.44 154.43,97.16 144.91,106.68 76.96,106.68 74.42,104.14 69.98,104.14 R20.2
  Bottom 0.762: U1.5 64.9,98.42 69.98,103.5 R20.2 | D16.A 149.99,34.29 146.81,37.47 v146.81,41.91 146.81,43.81 v152.53,49.53
GND
  Top 0.762: 62.36,102.23 62.36,103.5 R20.1 | 62.36,102.23 62.36,100.97 R15.1 | 76.33,102.23 76.33,103.5 R10.1 | 76.33,102.23 76.33,100.97 R8.1 | 76.33,102.23 62.36,102.23 | U1.12 47.75,97.16 47.75,100.33 C5.1 | ADDRESS.6 31.88,18.41 29.97,18.41 ADDRESS.7 29.34,18.41 27.43,18.41 ADDRESS.8 26.8,18.41 24.89,18.41 ADDRESS.9 24.26,18.41 22.35,18.41 ADDRESS.10 | 7.11,76.83 7.75,76.83 IC1.8 | 7.11,76.83 4.57,76.83 C13.1 | 7.11,76.83 8.38,75.56 | 8.38,75.56 9.65,74.3 | 9.65,74.3 C14.1 | IC1.10 16,80.64 9.65,74.3 | IC1.15 17.27,93.34 24.26,86.36 Q9.1 | 8.38,75.56 8.38,40 12.83,35.56 X1.5 | R5.1 91.57,29.84 88.39,29.84 R6.1 87.76,29.84 84.58,29.84 R7.1 83.95,29.84 80.77,29.84 R9.1 80.14,29.84 76.96,29.84 R4.2 76.33,29.84 73.15,29.84 R3.2 72.52,29.84 69.34,29.84 R2.2 68.71,29.84 65.53,29.84 R1.2 | LOW_POWER_OUTPUT.B4 47.12,12.7 47.12,12.07 49.02,10.16 49.66,10.16 52.2,12.7 LOW_POWER_OUTPUT.B6 | D18.A D4.A D6.A D13.A 122.68,47.62 113.79,47.62 105.54,55.88 C9.2 | D1.C D5.A | D11.C D12.A D5.A | D16.C D17.A | D2.C D3.A | D3.A D17.A | D17.A 137.29,25.4 D21.A | D3.A D5.A | 146.18,78.74 150.62,78.74 | 150.62,78.74 R21.2 | 146.18,78.74 141.73,74.3 C6.- | 150.62,78.74 150.62,92.08 151.89,93.34 151.89,96.52 C7.2 | 146.18,78.74 139.83,85.09 139.83,97.79 U3.2
  Bottom 0.762: PICKIT2.3 35.05,102.87 35.05,102.23 36.96,100.33 47.75,100.33 C5.1 48.39,100.33 49.66,99.06 54.1,99.06 55.37,100.33 61.72,100.33 R15.1 | X1.5 13.46,34.92 20.45,27.94 20.45,19.69 21.72,18.41 ADDRESS.10 | 106.17,73.03 106.17,71.75 108.08,69.85 IC3.8 | 106.17,73.03 106.17,81.92 C8.2 | 42.04,71.12 Q10.1 Q9.1 15.37,71.12 12.83,73.66 C14.1 | 42.04,71.12 Q11.1 Q12.1 Q13.1 Q14.1 | 42.04,71.12 U1.31 47.12,86.36 U1.12 | 106.17,73.03 83.31,73.03 Q14.1 | LOW_POWER_OUTPUT.B2 42.04,12.7 42.04,12.07 43.94,10.16 44.58,10.16 47.12,12.7 LOW_POWER_OUTPUT.B4 | 54.74,10.16 54.1,10.16 52.2,12.07 52.2,12.7 LOW_POWER_OUTPUT.B6 | 54.74,10.16 57.28,12.7 LOW_POWER_OUTPUT.B8 | 59.82,10.16 61.72,12.07 61.72,12.7 LOW_POWER_OUTPUT.B10 | 54.74,10.16 59.82,10.16 | 59.82,10.16 64.9,10.16 66.8,12.07 66.8,12.7 LOW_POWER_OUTPUT.B12 67.44,13.34 70.61,16.51 70.61,22.86 69.34,24.13 69.34,29.84 R2.2 | 139.83,62.87 141.1,64.13 141.1,73.66 C6.- | 139.83,62.87 136.02,59.05 U2.2 | IC2.8 108.08,96.52 106.17,98.42 106.17,99.7 107.44,100.97 137.29,100.97 139.83,98.42 U3.2 | 139.83,62.87 139.83,46.36 | 139.83,46.36 D11.C | D13.A 127.76,46.36 139.83,46.36 | 97.28,49.53 103.63,55.88 104.9,55.88 C9.2 | 97.28,49.53 92.2,44.45 92.2,30.48 R5.1 | Q14.1 81.41,69.85 97.28,53.98 97.28,49.53
  pour Top: 0.51,110.11 157.1,110.11 157.1,0.51 0.51,0.51
  pour Bottom: 0.51,110.11 157.1,110.11 157.1,0.51 0.51,0.51
I/O_0  (via drill 0.61)
  Top 0.254: R1.1 65.53,22.86 67.44,22.86 69.98,25.4 75.69,25.4 80.14,20.95 81.41,20.95 82.68,19.69 82.68,14.61 81.41,13.34 GPIO_IN(OUT).B4 | U1.20 40.77,82.55 40.77,80.64 53.47,67.94 53.47,52.7 v54.1,52.07
  Bottom 0.254: v54.1,52.07 54.1,33.66 64.9,22.86 R1.1
I/O_1  (via drill 0.61)
  Top 0.254: v17.27,74.93 17.27,62.23 16,60.96 16,12.7 21.72,6.99 73.15,6.99 78.87,12.7 GPIO_IN(OUT).B3
  Bottom 0.254: R4.1 76.96,22.23 78.87,22.23 80.14,20.95 81.41,20.95 82.68,19.69 82.68,11.43 82.04,10.79 80.14,10.79 78.23,12.7 GPIO_IN(OUT).B3 | U1.21 23.62,81.28 v17.27,74.93
I/O_2  (via drill 0.61)
  Top 0.254: v64.26,27.3 40.77,27.3 34.42,20.95 34.42,10.79 37.59,7.62 71.25,7.62 76.33,12.7 GPIO_IN(OUT).B2 | U1.22 29.34,68.58 v33.78,64.13
  Bottom 0.254: R2.1 68.71,22.86 v64.26,27.3 63.63,27.94 63.63,55.24 67.44,59.05 67.44,61.59 64.9,64.13 v33.78,64.13
I/O_3  (via drill 0.61)
  Top 0.254: U1.23 33.15,82.55 37.59,82.55 38.23,81.92 v38.23,69.85
  Bottom 0.254: GPIO_IN(OUT).B1 73.15,13.34 71.88,14.61 71.88,19.69 72.52,20.32 72.52,22.23 R3.1 73.15,22.86 74.42,24.13 74.42,54.61 78.87,59.05 78.87,61.59 70.61,69.85 v38.23,69.85
I/O_4
  Top 0.254: U1.7 59.82,104.78 56.01,108.58 12.83,108.58 1.4,97.16 1.4,20.32 16,5.72 88.39,5.72 95.38,12.7 TRACK_STATUS.B4
  Bottom 0.254: R5.2 91.57,22.23 89.66,22.23 88.39,20.95 87.12,20.95 85.85,19.69 85.85,11.43 86.49,10.79 93.47,10.79 95.38,12.7 TRACK_STATUS.B4
I/O_5  (via drill 0.61)
  Top 0.254: TRACK_STATUS.B3 92.84,12.7 90.3,10.16 v85.22,10.16 81.41,6.35 16.64,6.35 2.03,20.95 2.03,96.52 13.46,107.95 55.37,107.95 57.28,106.05 U1.8
  Bottom 0.254: v85.22,10.16 85.22,20.32 87.12,22.23 87.76,22.23 R6.2
I/O_6  (via drill 0.61)
  Top 0.254: R7.2 84.58,22.23 84.58,12.7 86.49,10.79 88.39,10.79 90.3,12.7 TRACK_STATUS.B2 | U1.9 56.64,94.61 68.07,94.61 83.31,79.38 v83.31,66.04
  Bottom 0.254: v83.31,66.04 83.31,64.77 90.93,57.15 90.93,31.12 84.58,24.77 84.58,22.86 R7.2
I/O_7  (via drill 0.61)
  Top 0.254: R9.2 80.77,22.86 82.68,22.86 83.31,23.5 85.22,23.5 85.85,22.86 85.85,14.61 87.12,13.34 TRACK_STATUS.B1 | v52.2,90.81 58.55,84.45 58.55,75.56 66.8,67.31 70.61,67.31 75.69,62.23 v75.69,52.7
  Bottom 0.254: v52.2,90.81 U1.10 | v75.69,52.7 75.69,33.02 78.87,29.84 78.87,24.13 80.14,22.86 R9.2
IDENTBIT0  (via drill 0.61)
  Top 0.254: U1.28 30.61,95.25 30.61,97.16 29.97,97.79 26.16,97.79 25.53,97.16 25.53,88.27 28.07,85.72 28.07,78.11 25.53,75.56 25.53,70.48 24.26,69.22 v23.62,69.22
  Bottom 0.254: ADDRESS.1 22.35,10.16 24.26,8.26 32.51,8.26 33.78,9.53 33.78,22.86 29.34,27.3 23.62,27.3 22.99,27.94 22.99,29.21 22.35,29.84 R26.1 21.72,30.48 17.91,34.29 17.91,62.87 23.62,68.58 v23.62,69.22
IDENTBIT1  (via drill 0.61)
  Top 0.254: 19.18,25.4 24.26,30.48 R25.1 | 19.18,25.4 18.54,24.77 18.54,14.61 20.45,12.7 22.35,12.7 24.26,10.79 ADDRESS.2 | v20.45,72.39 20.45,62.87 17.91,60.33 17.91,26.67 19.18,25.4
  Bottom 0.254: U1.27 42.04,80.64 33.78,72.39 v20.45,72.39
IDENTBIT2  (via drill 0.61)
  Top 0.254: ADDRESS.3 26.8,10.79 20.45,17.15 20.45,23.5 26.8,29.84 R22.1 | U1.24 30.61,77.47 v30.61,69.22
  Bottom 0.254: v30.61,69.22 19.18,57.79 19.18,37.47 26.8,29.84 R22.1
IDENTBIT3  (via drill 0.61)
  Top 0.254: v19.18,27.3 19.18,29.21 21.72,31.75 28.07,31.75 29.34,30.48 R23.1 | U1.25 36.96,70.48 v33.15,66.67
  Bottom 0.254: IC1.11 35.05,83.19 U1.25 | v19.18,27.3 19.18,18.41 21.72,15.88 24.26,15.88 29.34,10.79 ADDRESS.4 | v33.15,66.67 29.34,66.67 19.81,57.15 19.81,49.53 29.34,40 29.34,30.48 R23.1
IDENTBIT4
  Top 0.254: R24.1 32.51,29.84 33.78,28.57 33.78,17.15 32.51,15.88 32.51,10.79 ADDRESS.5 31.88,10.16 29.97,8.26 21.72,8.26 17.27,12.7 17.27,60.96 18.54,62.23 18.54,83.82 IC1.12
  Bottom 0.254: IC1.12 35.05,85.72 U1.26
N$1
  Top 0.254: PICKIT2.2 37.59,103.5 39.5,105.41 45.21,105.41 D22.C
N$2
  Bottom 0.254: R39.2 145.54,59.05 145.54,36.83 134.11,25.4 134.11,22.86 129.67,18.41 127.76,18.41 CAN_TERM.2
N$3  (via drill 3.2 pad 6.45)
  other vias: 4.42,106.2
N$4  (via drill 3.2 pad 6.45)
  other vias: 153.17,106.15
N$5  (via drill 3.2 pad 6.45)
  other vias: 4.43,4.43
N$6  (via drill 3.2 pad 6.45)
  other vias: 153.2,4.41
N$7  (via drill 0.61)
  other vias: 35.69,32.39
N$8
  Top 0.254: IC1.5 7.75,84.45 4.57,84.45 C10.2
N$9
  Top 0.254: IC1.4 8.38,88.9 4.57,88.9 C10.1
N$10
  Top 0.254: IC1.1 8.38,96.52 4.57,96.52 C11.1
N$11
  Top 0.254: IC1.3 8.38,91.44 4.57,91.44 C11.2
N$12
  Top 0.254: IC1.2 10.92,95.25 10.92,100.33 10.29,100.97 C12.2
N$13
  Bottom 0.254: IC1.6 7.75,81.92 4.57,81.92 C13.2
N$14  (via drill 0.61)
  other vias: 72.52,32.39
N$15
  Top 0.254: IC1.13 10.29,81.92 7.75,81.92 3.3,77.47 3.3,33.02 9.65,26.67 10.92,26.67 13.46,29.21 X1.3
N$16  (via drill 0.61)
  Top 0.254: v11.56,85.72 IC1.14
  Bottom 0.254: v11.56,85.72 11.56,78.11 7.75,74.3 7.75,28.57 9.65,26.67 12.83,26.67 X1.2
N$17
  Top 0.254: X1.6 10.92,25.4 13.46,25.4 14.73,26.67 14.73,30.48 13.46,31.75 X1.4
N$18
  Top 0.254: X1.7 10.92,28.57 10.92,30.48 X1.8
N$20
  Top 0.254: R39.1 152.53,67.94 143.64,59.05 U2.7
  Bottom 0.254: R39.1 153.8,72.39 153.8,34.92 141.73,22.86 137.29,22.86 134.11,19.69 134.11,16.51 135.38,15.24 135.38,13.34 CAN.B1
N$21
  Top 0.254: CAN_TERM.1 127.76,10.79 136.65,10.79 138.56,12.7 CAN.B2 138.56,13.34 138.56,15.24 152.53,29.21 152.53,47.62 144.27,55.88 143.64,55.88 U2.6
N$27
  Bottom 0.254: R21.1 143.64,77.47 143.64,61.59 U2.8
N$28
  Top 0.254: T17.1 26.8,56.52 28.07,57.79 R28.2 24.26,64.77 Q9.3
N$29
  Bottom 0.762: POWER.B2 147.45,13.34 147.45,14.61 152.53,19.69 152.53,24.77 D21.C
N$30
  Top 0.254: Q9.2 21.72,74.93 R27.1
N$31
  Top 0.254: T18.1 38.23,56.52 39.5,57.79 R30.2 35.69,64.77 Q10.3
N$33
  Top 0.254: Q10.2 33.15,74.93 R29.1
N$34
  Top 0.254: T19.1 49.66,56.52 50.93,57.79 R32.2 47.12,64.77 Q11.3
N$36
  Top 0.254: Q11.2 44.58,74.93 R31.1
N$37
  Top 0.254: T20.1 61.09,56.52 62.36,57.79 R34.2 58.55,64.77 Q12.3
N$39
  Top 0.254: Q12.2 56.01,74.93 R33.1
N$40
  Top 0.254: T21.1 72.52,56.52 73.79,57.79 R36.2 69.98,64.77 Q13.3
N$42
  Top 0.254: Q13.2 67.44,74.93 R35.1
N$43
  Top 0.254: R38.2 85.22,57.79 83.95,56.52 T22.1
  Bottom 0.254: Q14.3 81.41,64.77 R38.2
N$45
  Top 0.254: Q14.2 78.87,74.93 R37.1
N$117
  Bottom 0.254: U1.1 73.79,95.25 64.26,95.25 63.63,95.89 63.63,100.97 61.72,102.87 40.13,102.87 PICKIT2.1
OUT0
  Bottom 0.254: R27.2 29.97,76.2 33.78,80.01 40.13,80.01 40.77,80.64 40.77,81.92 41.4,82.55 45.85,82.55 U1.29
OUT0-1  (via drill 0.61)
  Top 0.762: v45.85,52.07 24.89,52.07 21.72,55.24 21.72,55.88 T17.3
  Bottom 0.762: v45.85,52.07 45.85,43.81 42.04,40 42.04,24.77 36.96,19.69 36.96,15.24 38.86,13.34 LOW_POWER_OUTPUT.B1
OUT1
  Bottom 0.254: R29.2 43.31,80.01 48.39,80.01 U1.30
OUT1-1  (via drill 0.61)
  Top 0.762: v42.04,10.16 44.58,12.7 LOW_POWER_OUTPUT.B3
  Bottom 0.762: v42.04,10.16 38.86,10.16 35.69,13.34 35.69,29.21 30.61,34.29 30.61,40 33.15,42.55 33.15,55.88 T18.3
OUT2
  Top 0.254: R31.2 52.2,76.2 U1.33
OUT2-1  (via drill 0.61)
  Top 0.762: v40.77,25.4 35.69,20.32 v35.69,11.43
  Bottom 0.762: v40.77,25.4 40.77,44.45 44.58,48.26 44.58,55.88 T19.3 | v35.69,11.43 38.23,8.89 45.85,8.89 49.66,12.7 LOW_POWER_OUTPUT.B5
OUT3
  Top 0.254: R33.2 62.36,78.74 U1.34
OUT3-1  (via drill 0.61)
  Top 0.762: v43.31,25.4 38.86,20.95 38.23,20.95 36.96,19.69 36.96,12.07 40.13,8.89 50.93,8.89 54.74,12.7 LOW_POWER_OUTPUT.B7
  Bottom 0.762: v43.31,25.4 52.2,34.29 52.2,52.07 56.01,55.88 T20.3
OUT4
  Bottom 0.254: R35.2 72.52,76.2 U1.37
OUT4-1  (via drill 0.61)
  Top 0.762: v71.25,24.13 71.25,12.07 68.07,8.89 62.99,8.89 59.18,12.7 LOW_POWER_OUTPUT.B9
  Bottom 0.762: v71.25,24.13 71.25,29.84 64.9,36.2 64.9,40 67.44,42.55 67.44,55.88 T21.3
OUT5
  Bottom 0.254: R37.2 79.5,76.2 75.69,80.01 71.25,80.01 U1.38
OUT5-1  (via drill 0.61)
  Top 0.762: v83.31,26.67 67.44,26.67 63.63,22.86 63.63,21.59 64.26,20.95 68.07,20.95 69.34,19.69 69.34,12.07 67.44,10.16 66.8,10.16 64.26,12.7 LOW_POWER_OUTPUT.B11
  Bottom 0.762: v83.31,26.67 86.49,29.84 86.49,40 78.87,47.62 78.87,55.88 T22.3
PGC
  Top 0.254: U1.39 72.52,87.63 66.17,93.98 45.21,93.98 43.31,95.89 43.31,100.97 47.12,104.78 47.12,106.05 45.85,107.31 33.78,107.31 29.97,103.5 PICKIT2.5
PGD
  Top 0.254: U1.40 73.79,80.01 69.34,80.01 68.71,80.64 68.71,90.17 65.53,93.34 40.77,93.34 38.23,95.89 38.23,97.16 34.42,100.97 33.78,100.97 31.88,102.87 PICKIT2.4
RAIL_POWER  (via drill 0.61)
  Top 0.762: D14.C D7.C D9.C D19.C | v107.44,99.06 105.54,99.06 103,96.52 IC2.4 | IC3.4 103,69.85 105.54,72.39 v107.44,72.39 | D20.C D10.C D8.C D15.C 89.03,50.8 | R38.1 81.41,57.15 81.41,56.52 T22.2 81.41,55.88 81.41,55.24 83.31,53.34 86.49,53.34 89.03,50.8 | R36.1 69.98,57.15 69.98,56.52 T21.2 | R34.1 58.55,57.15 58.55,56.52 T20.2 | R32.1 47.12,57.15 47.12,56.52 T19.2 | R28.1 24.26,57.15 24.26,56.52 T17.2 | R30.1 35.69,57.15 35.69,56.52 T18.2 | v107.44,76.2 90.3,76.2 89.03,74.93 89.03,50.8
  Bottom 0.762: D19.C 116.33,23.5 117.6,23.5 130.94,10.16 138.56,10.16 141.1,12.7 144.27,12.7 POWER.B1 | 125.86,99.7 108.08,99.7 v107.44,99.06 | 125.86,99.7 128.4,99.7 129.67,98.42 136.65,98.42 U3.1 | v107.44,72.39 v107.44,76.2 113.79,82.55 117.6,82.55 125.86,90.81 125.86,99.7 | 29.97,59.05 26.16,59.05 24.26,57.15 24.26,56.52 T17.2 | R30.1 29.97,59.05 | R32.1 42.04,60.96 40.13,59.05 | 29.97,59.05 40.13,59.05 | R34.1 53.47,60.96 51.56,59.05 | 40.13,59.05 51.56,59.05 | R36.1 64.9,60.96 62.99,59.05 51.56,59.05 | R38.1 76.33,60.96 74.42,59.05 71.88,59.05 69.98,57.15 69.98,56.52 T21.2 | D7.C 104.9,38.73 101.73,38.73 99.19,41.27 96.01,41.27 D8.C
S1T0  (via drill 0.61)
  Top 0.254: U1.6 63.63,97.79 70.61,97.79 71.25,97.16 71.25,95.89 78.87,88.27 92.2,88.27 93.47,89.53 v93.47,91.44
  Bottom 0.254: v93.47,91.44 97.28,91.44 98.55,92.71 102.36,92.71 104.27,90.81 IC2.5
S1T1  (via drill 0.61)
  Top 0.254: v97.28,45.72 v97.28,39.37
  Bottom 0.254: U1.14 40.13,98.42 7.75,98.42 2.67,93.34 2.67,21.59 17.27,6.99 92.2,6.99 96.65,11.43 96.65,31.75 97.28,32.39 v97.28,39.37 | v97.28,45.72 106.81,55.24 106.81,60.33 104.27,62.87 IC3.5
S1T2  (via drill 0.61)
  Top 0.254: U1.16 36.96,95.89 40.77,92.08 v62.99,92.08 | v91.57,89.53 v87.76,89.53
  Bottom 0.254: v62.99,92.08 66.17,88.9 87.12,88.9 v87.76,89.53 | v91.57,89.53 95.38,89.53 100.46,84.45 115.7,84.45 120.14,88.9 120.14,90.81 118.24,92.71 112.52,92.71 110.62,94.61 IC2.10
S1T3  (via drill 0.61)
  Top 0.254: v116.97,60.33 v111.25,54.61
  Bottom 0.254: U1.18 30.61,97.79 8.38,97.79 3.3,92.71 3.3,29.84 20.45,12.7 20.45,9.53 22.35,7.62 80.14,7.62 84.58,12.07 84.58,20.95 93.47,29.84 93.47,41.27 94.74,42.55 98.55,42.55 110.62,54.61 v111.25,54.61 | v116.97,60.33 118.87,62.23 118.87,64.77 117.6,66.04 112.52,66.04 110.62,67.94 IC3.10
S2T0  (via drill 0.61)
  Top 0.254: U1.13 44.58,99.06 v49.66,104.14 | v97.28,99.06 97.28,97.16 98.55,95.89 98.55,93.98 99.82,92.71 104.9,92.71 106.81,90.81 IC2.7
  Bottom 0.254: v49.66,104.14 60.45,104.14 61.72,105.41 90.93,105.41 v97.28,99.06
S2T1  (via drill 0.61)
  Top 0.254: v39.5,88.27 45.85,81.92 45.85,76.83 55.37,67.31 59.18,67.31 64.9,61.59 64.9,55.24 68.71,51.44 87.12,51.44 93.47,45.09 v93.47,43.18
  Bottom 0.254: v39.5,88.27 U1.15 | v93.47,43.18 96.65,43.18 107.44,53.98 107.44,62.87 IC3.7
S2T2  (via drill 0.61)
  Top 0.254: U1.17 43.31,87.63 v53.47,87.63 | v101.09,85.72 v87.76,85.72 | v118.87,90.17 118.87,91.44 117.6,92.71 115.06,92.71 113.16,94.61 IC2.12
  Bottom 0.254: v53.47,87.63 85.85,87.63 v87.76,85.72 | v101.09,85.72 115.7,85.72 118.87,88.9 v118.87,90.17
S2T3  (via drill 0.61)
  Top 0.254: v54.74,86.36 v45.85,86.36 | v87.76,83.82 102.36,83.82 109.98,76.2 v111.25,76.2
  Bottom 0.254: U1.19 39.5,86.36 v45.85,86.36 | v54.74,86.36 68.71,86.36 71.25,83.82 v87.76,83.82 | v111.25,76.2 111.25,71.12 113.16,69.22 IC3.12
T0-1  (via drill 0.61)
  Top 0.762: CONNECT_RAILS.B1 101.09,13.34 99.19,15.24 99.19,17.78 95.38,21.59 C2.1 95.38,29.84 99.19,33.66 99.19,38.73 100.46,40 100.46,53.98 | D6.C D7.A 113.79,40.64 100.46,53.98 | v90.3,74.3 90.3,64.13 100.46,53.98
  Bottom 0.762: IC2.2 97.92,97.79 96.65,97.79 96.01,98.42 94.11,98.42 90.3,94.61 v90.3,74.3
T1-1  (via drill 0.61)
  Top 0.762: 109.98,32.39 D9.A D4.C 122.05,33.02 v122.05,26.67 | 109.98,32.39 C1.1 | v129.03,19.69 129.03,15.88 120.78,7.62 111.25,7.62 106.81,12.07 106.81,12.7 CONNECT_RAILS.B3 | v100.46,57.79 100.46,55.88 v111.89,44.45 | 109.98,32.39 v109.98,42.55
  Bottom 0.762: v122.05,26.67 v129.03,19.69 | IC3.2 97.28,71.75 94.11,71.75 91.57,69.22 91.57,66.67 v100.46,57.79 | v109.98,42.55 v111.89,44.45
T1-2  (via drill 0.61)
  Top 0.762: v113.16,31.12 111.25,31.12 108.08,27.94 C1.2 | v98.55,40 v98.55,52.7
  Bottom 0.762: 106.81,26.67 102.36,31.12 101.73,31.12 100.46,32.39 100.46,34.29 102.36,36.2 | 106.81,26.67 C1.2 | 102.36,36.2 D10.A 102.36,36.2 | D3.C 127.76,34.92 123.32,34.92 119.51,31.12 v113.16,31.12 | 106.81,26.67 103.63,23.5 103,23.5 99.19,19.69 99.19,12.07 101.09,10.16 106.81,10.16 108.71,12.07 108.71,12.7 CONNECT_RAILS.B4 | IC3.3 101.73,55.88 v98.55,52.7 | 102.36,36.2 v98.55,40
T2-1  (via drill 0.61)
  Top 0.762: v111.89,29.84 C4.1 | 115.06,44.45 D14.A 115.06,44.45 | 115.06,44.45 D13.C | v123.95,19.69 123.95,14.61 119.51,10.16 113.79,10.16 111.89,12.07 111.89,12.7 CONNECT_RAILS.B5 | IC2.13 114.43,85.72 125.86,74.3 125.86,62.23 v122.05,58.42 | v112.52,53.34 v117.6,58.42 | 115.06,44.45 v109.35,50.16
  Bottom 0.762: D14.A 111.89,41.91 v111.89,29.84 115.06,29.84 118.87,26.04 118.87,24.77 v123.95,19.69 | v117.6,58.42 v122.05,58.42 | v109.35,50.16 v112.52,53.34
T2-2  (via drill 0.61)
  Top 0.762: v119.51,27.94 C4.2 | v115.06,48.9 125.22,48.9 v125.86,48.26 D12.C 132.21,41.91 132.21,29.21 125.86,22.86 125.86,14.61 120.14,8.89 v114.43,8.89 | v127.13,95.89 v124.59,98.42
  Bottom 0.762: v119.51,27.94 127.76,27.94 132.21,32.39 132.21,41.91 D12.C | D15.A 107.44,48.9 v115.06,48.9 | v114.43,8.89 114.43,12.7 CONNECT_RAILS.B6 | IC2.14 118.87,98.42 v124.59,98.42 | v127.13,95.89 127.13,49.53 v125.86,48.26
T3-1  (via drill 0.61)
  Top 0.762: C3.1 120.78,30.48 D18.C 115.06,33.02 | 115.06,33.02 D19.A 115.06,33.02 | v121.41,17.78 121.41,19.69 120.14,20.95 116.33,20.95 115.06,22.23 115.06,33.02 | v121.41,36.2 v121.41,46.36
  Bottom 0.762: v121.41,17.78 121.41,12.07 119.51,10.16 118.87,10.16 116.97,12.07 116.97,12.7 CONNECT_RAILS.B7 | IC3.13 114.43,53.34 v121.41,46.36 | D18.C v121.41,36.2
T3-2  (via drill 0.61)
  Top 0.762: 122.68,22.23 v116.97,22.23 | 123.32,22.86 C3.2 129.67,29.21 D17.C | 123.32,22.86 122.68,22.23 | 122.68,22.23 122.68,16.51 119.51,13.34 CONNECT_RAILS.B8 | 123.32,22.86 v123.32,45.09
  Bottom 0.762: D20.A 109.98,26.04 109.98,24.77 112.52,22.23 v116.97,22.23 | IC3.14 118.87,71.75 122.05,71.75 124.59,69.22 124.59,46.36 v123.32,45.09
TO-2  (via drill 0.61)
  Top 0.762: C2.2 100.46,38.1 D8.A | v103.63,8.89 103.63,12.7 CONNECT_RAILS.B2 | IC2.3 101.73,88.9 106.81,83.82 114.43,83.82 124.59,73.66 124.59,62.87 v123.32,61.59 | v113.79,52.07 v117.6,52.07
  Bottom 0.762: D5.C 127.76,42.55 123.32,42.55 119.51,46.36 | 119.51,46.36 111.89,46.36 108.08,42.55 104.9,42.55 D8.A | v103.63,8.89 100.46,8.89 97.92,11.43 97.92,22.86 C2.2 | v123.32,61.59 123.32,57.79 v117.6,52.07 | 119.51,46.36 v113.79,52.07
VCC_5V  (via drill 0.61)
  Top 0.406: R26.2 22.35,22.86 24.26,22.86 R25.2 24.89,22.86 26.8,22.86 R22.2 27.43,22.86 29.34,22.86 R23.2 29.97,22.86 31.88,22.86 R24.2 | IC1.16 15.37,97.16 15.37,100.97 C12.1 | IC2.11 109.98,90.17 | 109.98,90.17 IC2.9 109.98,90.17 | IC2.6 105.54,94.61 109.98,90.17 | U1.11 49.66,97.16 52.83,100.33 C5.2 53.47,100.97 55.37,102.87 55.37,105.41 D22.A | 110.62,62.23 110.62,56.52 C9.1 | 110.62,62.23 IC3.9 109.35,64.13 105.54,67.94 IC3.6 105.54,69.22 107.44,71.12 v114.43,71.12 | 110.62,62.23 IC3.11 | 137.92,66.04 137.92,73.66 C6.+ | 137.92,66.04 137.92,58.42 136.02,56.52 U2.3 | v115.06,78.11 111.25,81.92 C8.1 | 137.92,66.04 v125.86,78.11
  Bottom 0.406: C14.2 15.37,76.83 14.73,77.47 14.73,80.01 | 14.73,80.01 14.73,93.98 IC1.16 | 14.73,80.01 9.02,74.3 9.02,73.03 15.37,66.67 15.37,34.92 21.72,28.57 21.72,22.86 R26.2 | U1.32 54.74,84.45 49.66,89.53 U1.11 | IC2.6 105.54,95.89 103,98.42 | 103,98.42 94.74,106.68 56.64,106.68 56.01,106.05 D22.A 55.37,106.05 54.1,107.31 28.7,107.31 22.99,101.6 15.37,101.6 C12.1 | 148.72,91.44 151.89,91.44 C7.1 | 148.72,91.44 142.37,97.79 U3.3 141.73,98.42 137.92,102.23 106.81,102.23 103,98.42 | v125.86,78.11 121.41,78.11 | 121.41,78.11 v115.06,78.11 | 148.72,91.44 148.72,85.09 137.92,74.3 C6.+ | 121.41,78.11 v114.43,71.12

### Text on the board
tNames: PIC18F4585-I | 1N4004 | 1N4148 | (Remove R23 & R24 if using MAX232) | RAIL / ROAD INTERFACE / V 1.2 - JULY 2023 / Philippe Cavenel | (Remove ADDRESS switch if using MAX232) | OUT | IN 5V MAX | OUT | OUT | H L | + -
DrillLegend: LAYER-STACK
DrillLegend_01-16: 01-16
DrillLegend_01-20: 01-20